# Altium project APP_1_rene0901.PrjPcb (part 1 of 2)
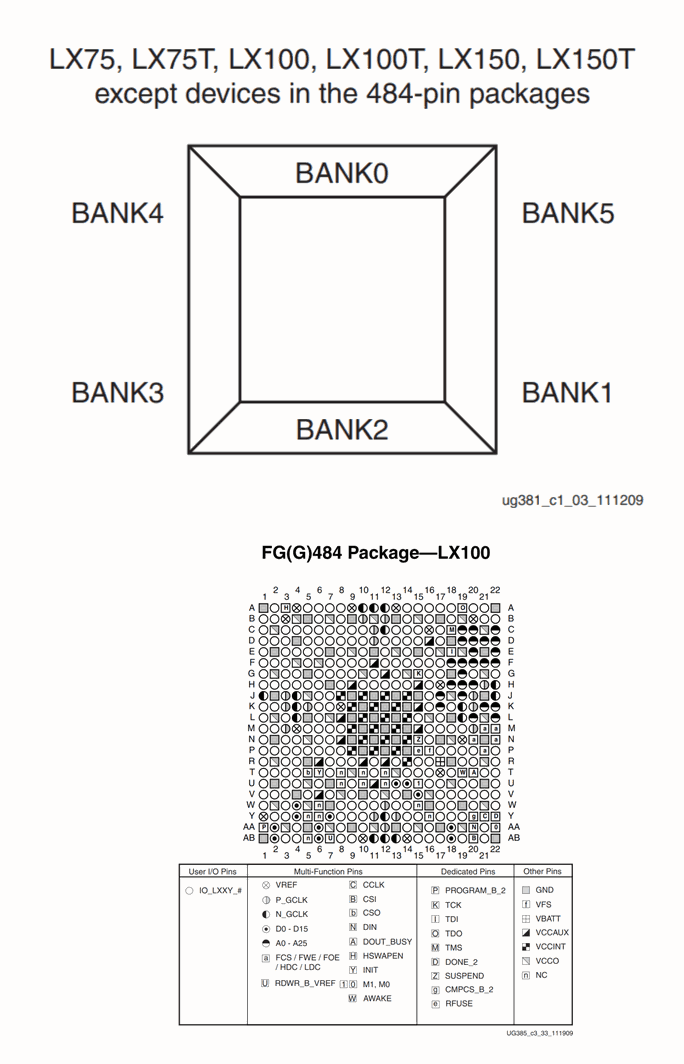
[diagram p0: APP_1_Overview.SchDoc]
Project_Date: 2024-01-12; Project_Designer1: Emile Renaud; Project_Designer2: Mathieu Huot; Project_Global: Conception PCB 1; Project_Group: N/A; Project_Name: APP_1_rene0901; Project_Revision: 1.00
13 sheets, 264 parts. Net scope: flat (ports and power ports of the same name join across sheets).
Sheets:
  APP_1_Title.SchDoc
  APP_1_Overview.SchDoc
  APP_1_Connectors_e.SchDoc
  APP_1_FPGA_e.SchDoc
  APP_1_DDR3_e.SchDoc
  APP_1_Prog.SchDoc
  APP_1_Stepper.SchDoc
  APP_1_DAC.SchDoc
  APP_1_ADC.SchDoc
  APP_1_Ethernet.SchDoc
  APP_1_Power.SchDoc
  APP_1_FlashSPI.SchDoc
  APP_1_PLL.SchDoc

## Sheet APP_1_Title.SchDoc
size Tabloid; DocumentNumber: 1; SheetNumber: 1; SheetTotal: 5; Sheet_Name: Insert name in Document Parameters; Size: 11x17

### Notes on the sheet
- Revision history
- Package size conversion
- Metric
- 1005
- 1608
- Imperial
- 0402
- 0603
- Revision
- 2012
- 3216
- 0805
- 1206
- 3225
- 6432
- 1210
- 2512
- Date :
- Project Title
- Global Project
- Size
- Date
- Group
- Sheet
- of
- Filename
- Designers

## Sheet APP_1_Overview.SchDoc: Overview
size Tabloid; DocumentNumber: 2; SheetNumber: 2; SheetTotal: 5; Sheet_Name: Overview; Size: 11x17

### Notes on the sheet
- Sheet Name
- Project Title
- Global Project
- Size
- Group
- Revision
- Date
- Sheet
- of
- Filename
- Designers

## Sheet APP_1_Connectors_e.SchDoc
size Tabloid; DocumentNumber: 3; SheetNumber: 3; SheetTotal: 12; Sheet_Name: Connectors; Size: 11x17
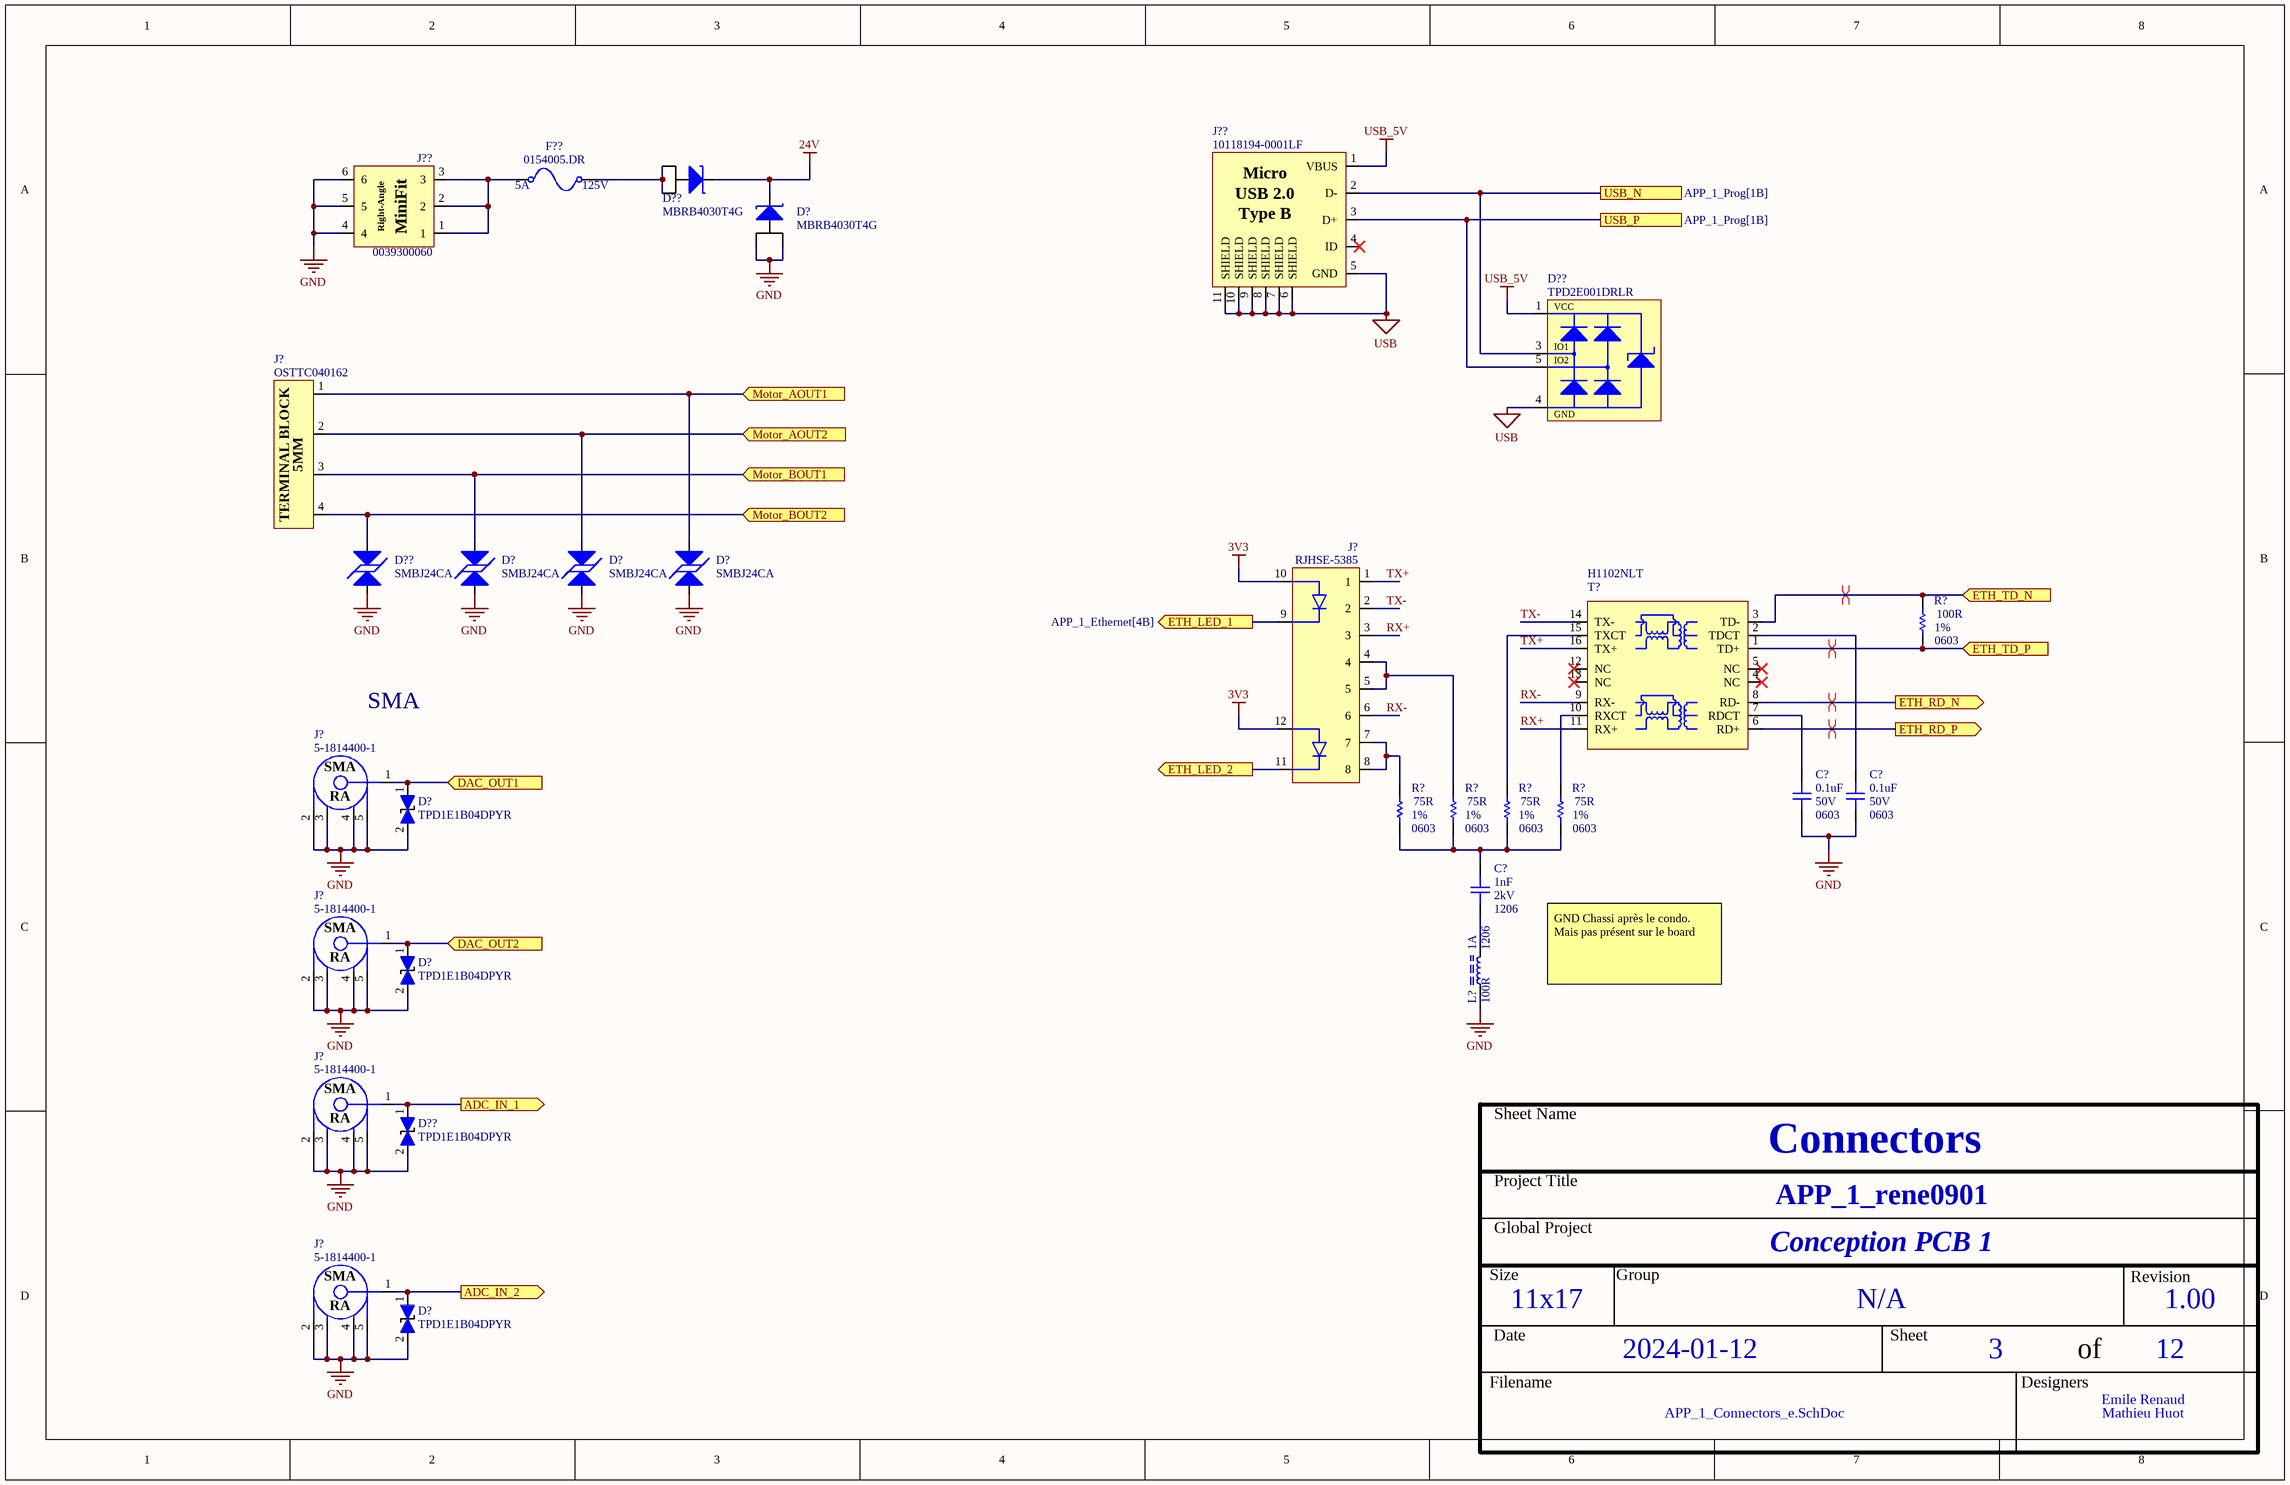
[diagram p1: APP_1_Connectors_e.SchDoc]

### Parts
(Parts that share a designator on the sheet are numbered #1, #2 ... from top to bottom, then left to right.)
C?#1  value 0.1uF  Voltage: 50V  Package: 0603  [CAP_0603]  (hidden comment: CAP - 0603)
C?#2  value 0.1uF  Voltage: 50V  Package: 0603  [CAP_0603]  (hidden comment: CAP - 0603)
C?#3  value 1nF  Voltage: 2kV  Package: 1206  [CAP_1206]  (hidden comment: CAP - 1206)
D?#1  MBRB4030T4G  [DIO_SCHOTTKY_MBRB4030T4G]
D?#2  SMBJ24CA  [TVS_PWR_SMBJ36CA]
D?#3  SMBJ24CA  [TVS_PWR_SMBJ36CA]
D?#4  SMBJ24CA  [TVS_PWR_SMBJ36CA]
D?#5  TPD1E1B04DPYR  [TVS_DATA_TPD1E1B04DPYR]
D?#6  TPD1E1B04DPYR  [TVS_DATA_TPD1E1B04DPYR]
D?#7  TPD1E1B04DPYR  [TVS_DATA_TPD1E1B04DPYR]
D??#1  MBRB4030T4G  [DIO_SCHOTTKY_MBRB4030T4G]
D??#2  TPD2E001DRLR  [TVS_USB_TPD2E001DRLR]
D??#3  SMBJ24CA  [TVS_PWR_SMBJ36CA]
D??#4  TPD1E1B04DPYR  [TVS_DATA_TPD1E1B04DPYR]
F??  0154005.DR  Voltage Rating: 125V  Current Rating: 5A  [FUS_0154XXX.DR]
J?#1  OSTTC040162  [CONN_TERMINAL_OSTTA040161]
J?#2  RJHSE-5385  [CONN_ETHERNET_RJHSE-5385]
J?#3  5-1814400-1  [CONN_SMA_5-1814400-1]
J?#4  5-1814400-1  [CONN_SMA_5-1814400-1]
J?#5  5-1814400-1  [CONN_SMA_5-1814400-1]
J?#6  5-1814400-1  [CONN_SMA_5-1814400-1]
J??#1  10118194-0001LF  [CON_USB_10118194-0001LF]
J??#2  0039300060  [CON_MINIFIT_0039300060]
L?#1  value 100R  Current: 1A  Package: 1206  [FER_1206]  (hidden comment: FER - 1206)
R?#1  value 100R  Package: 0603  Precision: 1%  [RES_0603]  (hidden comment: RES - 0603)
R?#2  value 75R  Package: 0603  Precision: 1%  [RES_0603]  (hidden comment: RES - 0603)
R?#3  value 75R  Package: 0603  Precision: 1%  [RES_0603]  (hidden comment: RES - 0603)
R?#4  value 75R  Package: 0603  Precision: 1%  [RES_0603]  (hidden comment: RES - 0603)
R?#5  value 75R  Package: 0603  Precision: 1%  [RES_0603]  (hidden comment: RES - 0603)
T?  H1102NLT  [TRANSFO_H1102NLT]

### Ports
ADC_IN_1 (out, see APP_1_ADC[1A]), ADC_IN_2 (out, see APP_1_ADC[1B]), DAC_OUT1 (in, see APP_1_DAC[5A]), DAC_OUT2 (in, see APP_1_DAC[5B]), ETH_LED_1 (out, see APP_1_Ethernet[4B]), ETH_LED_2 (out), ETH_RD_N (out, see APP_1_Ethernet[4B]), ETH_RD_P (out, see APP_1_Ethernet[4A]), ETH_TD_N (in, see APP_1_Ethernet[4A]), ETH_TD_P (in, see APP_1_Ethernet[4A]), Motor_AOUT1 (in, see APP_1_Stepper[5A]), Motor_AOUT2 (in, see APP_1_Stepper[5B]), Motor_BOUT1 (in, see APP_1_Stepper[5B]), Motor_BOUT2 (in, see APP_1_Stepper[5B]), USB_N (see APP_1_Prog[1B]), USB_P (see APP_1_Prog[1B])

### Nets
3V3: J?#2.10(LED1_A) J?#2.12(LED2_A)
24V: D?#1.4 D??#1.4
GND: C?#1.1 C?#2.1 D?#1.1(A) D?#1.3 D?#2.2 D?#3.2 D?#4.2 D?#5.2(i/o) D?#6.2(i/o) D?#7.2(i/o) D??#3.2 D??#4.2(i/o) J?#3.2 J?#3.3 J?#3.4 J?#3.5 J?#4.2 J?#4.3 J?#4.4 J?#4.5 J?#5.2 J?#5.3 J?#5.4 J?#5.5 J?#6.2 J?#6.3 J?#6.4 J?#6.5 J??#2.4 J??#2.5 J??#2.6 L?#1.2
USB: D??#2.4(GND) J??#1.5(GND) J??#1.6(SHIELD) J??#1.7(SHIELD) J??#1.8(SHIELD) J??#1.9(SHIELD) J??#1.10(SHIELD) J??#1.11(SHIELD)
USB_5V: D??#2.1(VCC) J??#1.1(VBUS)
ADC_IN_1: D??#4.1(i/o) J?#5.1 ; port ADC_IN_1
ADC_IN_2: D?#7.1(i/o) J?#6.1 ; port ADC_IN_2
DAC_OUT1: D?#5.1(i/o) J?#3.1 ; port DAC_OUT1
DAC_OUT2: D?#6.1(i/o) J?#4.1 ; port DAC_OUT2
ETH_LED_1: J?#2.9(LED1_K) ; port ETH_LED_1
ETH_LED_2: J?#2.11(LED2_K) ; port ETH_LED_2
ETH_RD_N: T?.8(RD-) ; port ETH_RD_N
ETH_RD_P: T?.6(RD+) ; port ETH_RD_P
ETH_TD_N: R?#1.2 T?.3(TD-) ; port ETH_TD_N
ETH_TD_P: R?#1.1 T?.1(TD+) ; port ETH_TD_P
Motor_AOUT1: D?#4.1 J?#1.1 ; port Motor_AOUT1
Motor_AOUT2: D?#3.1 J?#1.2 ; port Motor_AOUT2
Motor_BOUT1: D?#2.1 J?#1.3 ; port Motor_BOUT1
Motor_BOUT2: D??#3.1 J?#1.4 ; port Motor_BOUT2
RX+: J?#2.3 T?.11(RX+)
RX-: J?#2.6 T?.9(RX-)
TX+: J?#2.1 T?.16(TX+)
TX-: J?#2.2 T?.14(TX-)
USB_N: D??#2.3(IO1) J??#1.2(D-) ; port USB_N
USB_P: D??#2.5(IO2) J??#1.3(D+) ; port USB_P
NetC?#1_2: C?#1.2 T?.7(RDCT)
NetC?#2_2: C?#2.2 T?.2(TDCT)
NetC?#3_1: C?#3.1 L?#1.1
NetC?#3_2: C?#3.2 R?#2.1 R?#3.1 R?#4.1 R?#5.1
NetD??#1_1: D??#1.1(A) D??#1.3 F??.2
NetF??_1: F??.1 J??#2.1 J??#2.2 J??#2.3
NetJ?#2_4: J?#2.4 J?#2.5 R?#3.2
NetJ?#2_7: J?#2.7 J?#2.8 R?#2.2
NetR?#4_2: R?#4.2 T?.15(TXCT)
NetR?#5_2: R?#5.2 T?.10(RXCT)

Not connected (* = marked no-connect by the designer): D??#2 2(NC); J??#1 4(ID)*; T? 4(NC)* 5(NC)* 12(NC)* 13(NC)*

### Layout directives
differential pair: ETH_RD_N, ETH_RD_P, ETH_TD_N, ETH_TD_P

### Notes on the sheet
- SMA
- GND Chassi après le condo. Mais pas présent sur le board
- Sheet Name
- Project Title
- Global Project
- Size
- Group
- Revision
- Date
- Sheet
- of
- Filename
- Designers
- (in symbol CON_MINIFIT_0039300060) Right-Angle; MiniFit
- (in symbol CON_USB_10118194-0001LF) Micro; USB 2.0; Type B
- (in symbol CONN_SMA_5-1814400-1) SMA; RA
- (in symbol CONN_TERMINAL_OSTTC040162) TERMINAL BLOCK; 5MM

### Library data of the parts
C?#1 C?#2 = CAP - 0603: Precision: 10%; Current: *; CreatedBy: Jonathan Bouchard; Power: *
C?#3 = CAP - 1206: Precision: 10%; Current: *; CreatedBy: Jonathan Bouchard; Power: *
D?#1 D??#1 = DIO_SCHOTTKY_MBRB4030T4G: DIO - 30V MAX 40 A - TO-263-3; Manufacturer #1: ON Semiconductor; Value: Vf = 550mV @ 40A; Current Rating: 40A; GRAMS Lib Spec: 2.8; Magnetic Material: NO; Polarized: Yes; Cryo: UNKNOWN; Tolerance: *; Voltage Rating: 30V; Power Max: *; HelpURL: http://www.onsemi.com/pub/Collateral/MBRB4030-D.PDF; CreatedBy/Date: Arnaud Samson - 06/07/18; VerifiedBy: Jonathan Bouchard 2018-07-12; Temperature: -65°C ~ 175°C; Package: D2PAK; Manufacturer #2: *; Note: *; Assembly Type: SMD; Part Number #2: *; Part Number #1: MBRB4030T4G; Supplier 1: Digi-Key; Supplier Part Number 1: MBRB4030T4GOSCT-ND
D?#2-D?#4 D??#3 = TVS_PWR_SMBJ24CA: TVS - 24V 26.7V 600W - DO214AA; Manufacturer #1: Littelfuse Inc.; Value: Vbr = 26.7V -  Clamp = 38.9V; Voltage Rating: 24V Standoff; Current Rating: 15.5A; GRAMS Lib Spec: 2.8; Magnetic Material: UNKNOWN; Polarized: NO; Tolerance: *; Power Max: 600W; HelpURL: http://www.littelfuse.com/~/media/electronics/datasheets/tvs_diodes/littelfuse_tvs_diode_smbj_datasheet.pdf.pdf; CreatedBy/Date: Arnaud Samson - 06/07/18; VerifiedBy: Jonathan Bouchard - 2018-07-13; Temperature: -65°C ~ 150°C (TJ); Package: DO214AA; Manufacturer #2: *; Note: *; Assembly Type: SMD; Part Number #2: *; Part Number #1: SMBJ24CA; Supplier 1: Digi-Key; Supplier Part Number 1: SMBJ24CALFCT-ND; Cryo: UNKNOWN
D?#5-D?#7 D??#4 = TVS_DATA_TPD1E1B04DPYR: TVS - TVS DIODE 3.6V 8.5V - 0402; Manufacturer #1: Texas Instruments; Current Rating: 6.3Apeak; Power Max: 50Wpeak; GRAMS Lib Spec: 2.8; Magnetic Material: Unknown; Polarized: No; Value: *; Tolerance: *; Voltage Rating: 3.6V; HelpURL: http://www.ti.com/lit/ds/symlink/tpd1e1b04.pdf; CreatedBy/Date: Keven Deslandes - 2018/10/19; VerifiedBy: Caroline Paulin - 28 janv 2019; Temperature: -40°C ~ 125°C (TA); Package: 0402; Manufacturer #2: *; Note: *; Assembly Type: SMD; Part Number #2: *; Part Number #1: TPD1E1B04DPYR; Supplier 1: Digi-Key; Supplier Part Number 1: 296-47364-1-ND; Cryo: UNKNOWN
D??#2 = TVS_USB_TPD2E001DRLR: TVS - USB TVS DIODE 5.5V - SOT-553; Manufacturer #1: Texas Instruments; Value: 11V Breakdown; Voltage Rating: 5.5V (Max); GRAMS Lib Spec: 2.8; Magnetic Material: YES; Cryo: UNKNOWN; Tolerance: *; Current Rating: *; Power Max: *; HelpURL: http://www.ti.com/lit/ds/symlink/tpd2e001.pdf; CreatedBy/Date: Jonathan Bouchard 2018-07-10; VerifiedBy: Arnaud Samson 16-07-18; Temperature: -40°C ~ 85°C (TA); Package: SOT-553; Manufacturer #2: *; Note: *; Assembly Type: SMD; Part Number #2: *; Part Number #1: TPD2E001DRLR; Polarized: YES; Supplier 1: Digi-Key; Supplier Part Number 1: 296-21883-1-ND
F?? = FUS_0154005.DR: FUS - 5 A 125 VAC/VDC - 2-SMD; Manufacturer #1: Littelfuse Inc.; Value: 5A 125V AC/DC FAST; GRAMS Lib Spec: 2.8; Magnetic Material: UNKNOWN; Polarized: NO; Tolerance: *; Power Max: *; HelpURL: http://www.littelfuse.com/~/media/electronics/datasheets/fuses/littelfuse_fuse_154_154t_154l_154tl_datasheet.pdf.pdf; CreatedBy/Date: Arnaud Samson - 06/07/18; VerifiedBy: Jonathan Bouchard 2018-07-16; Temperature: -55°C ~ 125°C; Package: 2-SMD; Manufacturer #2: *; Note: *; Assembly Type: SMD; Part Number #2: *; Part Number #1: 0154005.DR; Supplier 1: Digi-Key; Supplier Part Number 1: F1228CT-ND; Cryo: UNKNOWN
J?#1 = CONN_TERMINAL_OSTTC040162: CONN -  TERMINAL BLOCK 4POS 5MM - TH; Mfg: On Shore Technology Inc.; Voltage: *; Current: *; Power: *; Mfg Part Number: OSTTC040162; HelpURL: http://www.on-shore.com/wp-content/uploads/2015/09/osttcxx0162.pdf; CreatedBy: Jonathan Bouchard; Temperature: -30°C ~ 105°C; Value: *; Precision: *; Package: TH-4; Supplier 1: Digikey; Supplier Part Number 1: ED2602-ND
J?#2 = CONN_ETHERNET_RJHSE-5385: CONN - MOD JACK RJ45 R/A ETHERNET - TH; Mfg: Amphenol; Voltage: *; Current: *; Power: *; Mfg Part Number: RJHSE-5385; HelpURL: https://www.amphenolcanada.com/ProductSearch/drawings/AC/RJHSE538X.pdf; CreatedBy: Jonathan Bouchard; Temperature: -55°C ~ 85°C; Value: *; Precision: *; Package: TH-12; Supplier 1: Digikey; Supplier Part Number 1: RJHSE-5385-ND
J?#3-J?#6 = CONN_SMA_5-1814400-1: CONN -  SMA JACK R/A 50 OHM - TH; Mfg: TE Connectivity AMP Connectors; Voltage: *; Current: *; Power: *; Mfg Part Number: 5-1814400-1; HelpURL: http://www.te.com/commerce/DocumentDelivery/DDEController?Action=srchrtrv&DocNm=1814400&DocType=Customer+Drawing&DocLang=English; CreatedBy: Jonathan Bouchard; Temperature: -55°C ~ 85°C; Value: *; Precision: *; Package: TH-5; Supplier 1: Digikey; Supplier Part Number 1: A97593-ND
J??#1 = CON_USB_10118194-0001LF: CON - USB MICRO B RECPT SMT R/A - 4PIN; Manufacturer #1: Amphenol FCI; Value: USB - Micro B; Voltage Rating: 100VAC; Current Rating: 1.8A; GRAMS Lib Spec: 2.8; Magnetic Material: YES; Cryo: UNKNOWN; Tolerance: *; Power Max: *; HelpURL: https://cdn.amphenol-icc.com/media/wysiwyg/files/drawing/10118194.pdf; CreatedBy/Date: Arnaud Samson - 09/07/18; VerifiedBy: Jonathan Bouchard 2018-07-12; Temperature: -30°C ~ 80°C; Package: 5-SMD; Manufacturer #2: *; Note: *; Assembly Type: SMD; Part Number #2: *; Part Number #1: 10118194-0001LF; Polarized: YES; Supplier 1: Digi-Key; Supplier Part Number 1: 609-4618-1-ND
J??#2 = CON_MINIFIT_0039300060: CON - Mini-Fit Through Hole, Right Angle 6 position; Manufacturer #1: Molex; Current Rating: 8A; GRAMS Lib Spec: 2.8; Magnetic Material: Unknown; Polarized: Yes; Voltage Rating: 600V; Assembly Type: TH; CreatedBy/Date: Joel Lemay 2018-06-21; HelpURL: https://www.molex.com/pdm_docs/sd/039300060_sd.pdf; Manufacturer #2: *; Package: TH; Part Number #1: 0039300060; Part Number #2: *; Power Max: *; Supplier 1: Digi-Key; Supplier Part Number 1: WM21353-ND; Temperature: - 40°C to + 80°C; Tolerance: *; Value: *; VerifiedBy: Caroline Paulin - 10 sept 2018; Cryo: UNKNOWN
T? = TRANSFO_H1102NLT: TRANSFO - ETHERNET 10/100B-TX - SMD-16; Mfg: Pulse Eng.; Value: 1:1 (350uH); Voltage: *; Current: *; Power: *; Mfg Part Number: H1102NLT; HelpURL: http://media.digikey.com/pdf/Data%20Sheets/Pulse%20PDFs/10_100BASE-T%20Single%20Port%20SMD%20Magnetics_Rev2008.pdf; CreatedBy: Jonathan Bouchard; Temperature: -40°C to 85°C; Precision: *; Package: SMD-16; Supplier 1: Digikey; Supplier Part Number 1: 553-1532-1-ND
L?#1 = FER - 1206: Voltage: *; CreatedBy: Jonathan Bouchard; Power: *; Precision: *
R?#1-R?#5 = RES - 0603: Current: *; CreatedBy: Jonathan Bouchard

## Sheet APP_1_FPGA_e.SchDoc
size Tabloid; DocumentNumber: 4; SheetNumber: 4; SheetTotal: 13; Sheet_Name: FPGA; Size: 11x17
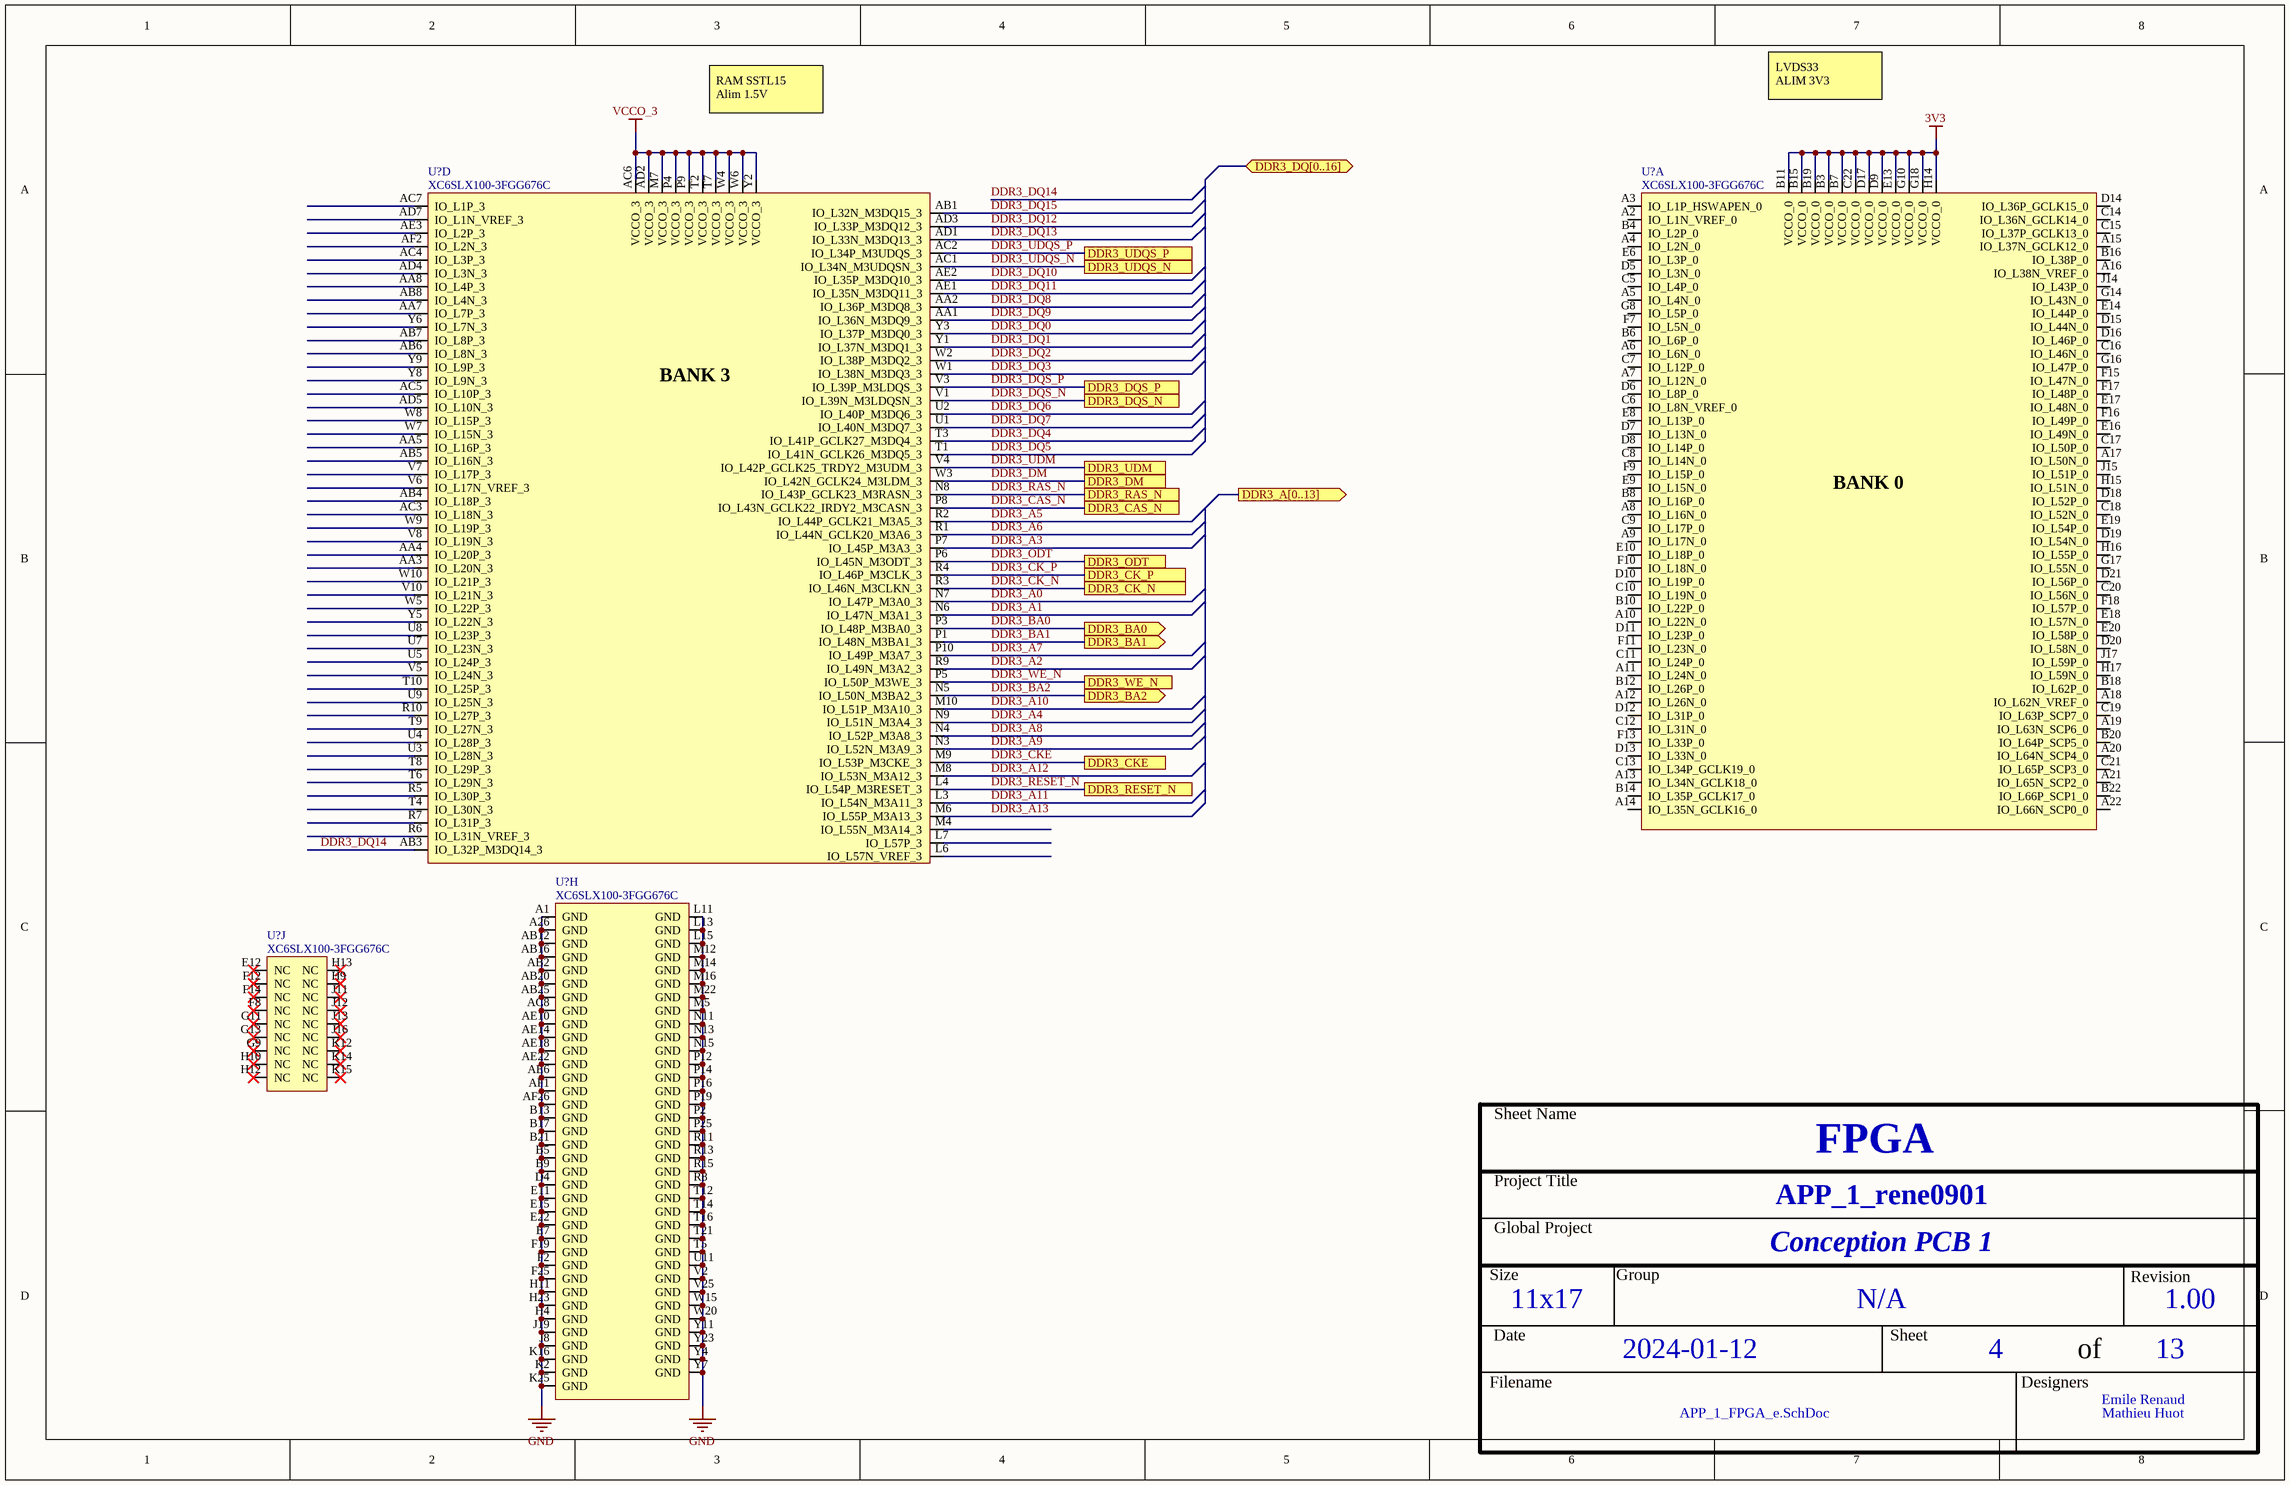
[diagram p2: APP_1_FPGA_e.SchDoc]

### Parts
(Parts that share a designator on the sheet are numbered #1, #2 ... from top to bottom, then left to right.)
U?#1  XC6SLX100-3FGG676C  [FPGA_XILINX_FGG676]  (part D of 10)
U?#2  XC6SLX100-3FGG676C  [FPGA_XILINX_FGG676]  (part A of 10)
U?#3  XC6SLX100-3FGG676C  [FPGA_XILINX_FGG676]  (part H of 10)
U?#4  XC6SLX100-3FGG676C  [FPGA_XILINX_FGG676]  (part J of 10)

### Ports
DDR3_A[0..13] (out, see APP_1_DDR3_e[1B]), DDR3_BA0 (out, see APP_1_DDR3_e[2C]), DDR3_BA1 (out, see APP_1_DDR3_e[2C]), DDR3_BA2 (out, see APP_1_DDR3_e[2C]), DDR3_CAS_N (see APP_1_DDR3_e[2D]), DDR3_CK_N (see APP_1_DDR3_e[1C]), DDR3_CK_P (see APP_1_DDR3_e[1C]), DDR3_CKE, DDR3_DM, DDR3_DQ[0..16] (bidir, see APP_1_DDR3_e[4B]), DDR3_DQS_N, DDR3_DQS_P, DDR3_ODT (see APP_1_DDR3_e[2D]), DDR3_RAS_N (see APP_1_DDR3_e[2C]), DDR3_RESET_N, DDR3_UDM (see APP_1_DDR3_e[4C]), DDR3_UDQS_N (see APP_1_DDR3_e[4C]), DDR3_UDQS_P (see APP_1_DDR3_e[4C]), DDR3_WE_N (see APP_1_DDR3_e[2D])

### Nets
3V3: U?#2.B3(VCCO_0) U?#2.B7(VCCO_0) U?#2.B11(VCCO_0) U?#2.B15(VCCO_0) U?#2.B19(VCCO_0) U?#2.C22(VCCO_0) U?#2.D9(VCCO_0) U?#2.D17(VCCO_0) U?#2.E13(VCCO_0) U?#2.G10(VCCO_0) U?#2.G18(VCCO_0) U?#2.H14(VCCO_0)
GND: U?#3.A1(GND) U?#3.A26(GND) U?#3.AB2(GND) U?#3.AB12(GND) U?#3.AB16(GND) U?#3.AB20(GND) U?#3.AB25(GND) U?#3.AC8(GND) U?#3.AE6(GND) U?#3.AE10(GND) U?#3.AE14(GND) U?#3.AE18(GND) U?#3.AE22(GND) U?#3.AF1(GND) U?#3.AF26(GND) U?#3.B5(GND) U?#3.B9(GND) U?#3.B13(GND) U?#3.B17(GND) U?#3.B21(GND) U?#3.D4(GND) U?#3.E7(GND) U?#3.E11(GND) U?#3.E15(GND) U?#3.E22(GND) U?#3.F2(GND) U?#3.F19(GND) U?#3.F25(GND) U?#3.H4(GND) U?#3.H11(GND) U?#3.H23(GND) U?#3.J8(GND) U?#3.J19(GND) U?#3.K2(GND) U?#3.K16(GND) U?#3.K25(GND) U?#3.L11(GND) U?#3.L13(GND) U?#3.L15(GND) U?#3.M5(GND) U?#3.M12(GND) U?#3.M14(GND) U?#3.M16(GND) U?#3.M22(GND) U?#3.N11(GND) U?#3.N13(GND) U?#3.N15(GND) U?#3.P2(GND) U?#3.P12(GND) U?#3.P14(GND) U?#3.P16(GND) U?#3.P19(GND) U?#3.P25(GND) U?#3.R8(GND) U?#3.R11(GND) U?#3.R13(GND) U?#3.R15(GND) U?#3.T5(GND) U?#3.T12(GND) U?#3.T14(GND) U?#3.T16(GND) U?#3.T21(GND) U?#3.U11(GND) U?#3.V2(GND) U?#3.V25(GND) U?#3.W15(GND) U?#3.W20(GND) U?#3.Y4(GND) U?#3.Y7(GND) U?#3.Y11(GND) U?#3.Y23(GND)
VCCO_3: U?#1.AC6(VCCO_3) U?#1.AD2(VCCO_3) U?#1.M7(VCCO_3) U?#1.P4(VCCO_3) U?#1.P9(VCCO_3) U?#1.T2(VCCO_3) U?#1.T7(VCCO_3) U?#1.W4(VCCO_3) U?#1.W6(VCCO_3) U?#1.Y2(VCCO_3)
DDR3_A0: U?#1.N7(IO_L47P_M3A0_3)
DDR3_A1: U?#1.N6(IO_L47N_M3A1_3)
DDR3_A2: U?#1.R9(IO_L49N_M3A2_3)
DDR3_A3: U?#1.P7(IO_L45P_M3A3_3)
DDR3_A4: U?#1.N9(IO_L51N_M3A4_3)
DDR3_A5: U?#1.R2(IO_L44P_GCLK21_M3A5_3)
DDR3_A6: U?#1.R1(IO_L44N_GCLK20_M3A6_3)
DDR3_A7: U?#1.P10(IO_L49P_M3A7_3)
DDR3_A8: U?#1.N4(IO_L52P_M3A8_3)
DDR3_A9: U?#1.N3(IO_L52N_M3A9_3)
DDR3_A10: U?#1.M10(IO_L51P_M3A10_3)
DDR3_A11: U?#1.L3(IO_L54N_M3A11_3)
DDR3_A12: U?#1.M8(IO_L53N_M3A12_3)
DDR3_A13: U?#1.M6(IO_L55P_M3A13_3)
DDR3_BA0: U?#1.P3(IO_L48P_M3BA0_3) ; port DDR3_BA0
DDR3_BA1: U?#1.P1(IO_L48N_M3BA1_3) ; port DDR3_BA1
DDR3_BA2: U?#1.N5(IO_L50N_M3BA2_3) ; port DDR3_BA2
DDR3_CAS_N: U?#1.P8(IO_L43N_GCLK22_IRDY2_M3CASN_3) ; port DDR3_CAS_N
DDR3_CK_N: U?#1.R3(IO_L46N_M3CLKN_3) ; port DDR3_CK_N
DDR3_CK_P: U?#1.R4(IO_L46P_M3CLK_3) ; port DDR3_CK_P
DDR3_CKE: U?#1.M9(IO_L53P_M3CKE_3) ; port DDR3_CKE
DDR3_DM: U?#1.W3(IO_L42N_GCLK24_M3LDM_3) ; port DDR3_DM
DDR3_DQ0: U?#1.Y3(IO_L37P_M3DQ0_3)
DDR3_DQ1: U?#1.Y1(IO_L37N_M3DQ1_3)
DDR3_DQ2: U?#1.W2(IO_L38P_M3DQ2_3)
DDR3_DQ3: U?#1.W1(IO_L38N_M3DQ3_3)
DDR3_DQ4: U?#1.T3(IO_L41P_GCLK27_M3DQ4_3)
DDR3_DQ5: U?#1.T1(IO_L41N_GCLK26_M3DQ5_3)
DDR3_DQ6: U?#1.U2(IO_L40P_M3DQ6_3)
DDR3_DQ7: U?#1.U1(IO_L40N_M3DQ7_3)
DDR3_DQ8: U?#1.AA2(IO_L36P_M3DQ8_3)
DDR3_DQ9: U?#1.AA1(IO_L36N_M3DQ9_3)
DDR3_DQ10: U?#1.AE2(IO_L35P_M3DQ10_3)
DDR3_DQ11: U?#1.AE1(IO_L35N_M3DQ11_3)
DDR3_DQ12: U?#1.AD3(IO_L33P_M3DQ12_3)
DDR3_DQ13: U?#1.AD1(IO_L33N_M3DQ13_3)
DDR3_DQ14: U?#1.AB3(IO_L32P_M3DQ14_3)
DDR3_DQ15: U?#1.AB1(IO_L32N_M3DQ15_3)
DDR3_DQS_N: U?#1.V1(IO_L39N_M3LDQSN_3) ; port DDR3_DQS_N
DDR3_DQS_P: U?#1.V3(IO_L39P_M3LDQS_3) ; port DDR3_DQS_P
DDR3_ODT: U?#1.P6(IO_L45N_M3ODT_3) ; port DDR3_ODT
DDR3_RAS_N: U?#1.N8(IO_L43P_GCLK23_M3RASN_3) ; port DDR3_RAS_N
DDR3_RESET_N: U?#1.L4(IO_L54P_M3RESET_3) ; port DDR3_RESET_N
DDR3_UDM: U?#1.V4(IO_L42P_GCLK25_TRDY2_M3UDM_3) ; port DDR3_UDM
DDR3_UDQS_N: U?#1.AC1(IO_L34N_M3UDQSN_3) ; port DDR3_UDQS_N
DDR3_UDQS_P: U?#1.AC2(IO_L34P_M3UDQS_3) ; port DDR3_UDQS_P
DDR3_WE_N: U?#1.P5(IO_L50P_M3WE_3) ; port DDR3_WE_N

Not connected (* = marked no-connect by the designer): U?#1 AA3(IO_L20N_3) AA4(IO_L20P_3) AA5(IO_L16P_3) AA7(IO_L7P_3) AA8(IO_L4P_3) AB4(IO_L18P_3) AB5(IO_L16N_3) AB6(IO_L8N_3) AB7(IO_L8P_3) AB8(IO_L4N_3) AC3(IO_L18N_3) AC4(IO_L3P_3) AC5(IO_L10P_3) AC7(IO_L1P_3) AD4(IO_L3N_3) AD5(IO_L10N_3) AD7(IO_L1N_VREF_3) AE3(IO_L2P_3) AF2(IO_L2N_3) L6(IO_L57N_VREF_3) L7(IO_L57P_3) M4(IO_L55N_M3A14_3) R5(IO_L30P_3) R6(IO_L31N_VREF_3) R7(IO_L31P_3) R10(IO_L27P_3) T4(IO_L30N_3) T6(IO_L29N_3) T8(IO_L29P_3) T9(IO_L27N_3) T10(IO_L25P_3) U3(IO_L28N_3) U4(IO_L28P_3) U5(IO_L24P_3) U7(IO_L23N_3) U8(IO_L23P_3) U9(IO_L25N_3) V5(IO_L24N_3) V6(IO_L17N_VREF_3) V7(IO_L17P_3) V8(IO_L19N_3) V10(IO_L21N_3) W5(IO_L22P_3) W7(IO_L15N_3) W8(IO_L15P_3) W9(IO_L19P_3) W10(IO_L21P_3) Y5(IO_L22N_3) Y6(IO_L7N_3) Y8(IO_L9N_3) Y9(IO_L9P_3); U?#2 A2(IO_L1N_VREF_0) A3(IO_L1P_HSWAPEN_0) A4(IO_L2N_0) A5(IO_L4N_0) A6(IO_L6N_0) A7(IO_L12N_0) A8(IO_L16N_0) A9(IO_L17N_0) A10(IO_L22N_0) A11(IO_L24N_0) A12(IO_L26N_0) A13(IO_L34N_GCLK18_0) A14(IO_L35N_GCLK16_0) A15(IO_L37N_GCLK12_0) A16(IO_L38N_VREF_0) A17(IO_L50N_0) A18(IO_L62N_VREF_0) A19(IO_L63N_SCP6_0) A20(IO_L64N_SCP4_0) A21(IO_L65N_SCP2_0) A22(IO_L66N_SCP0_0) B4(IO_L2P_0) B6(IO_L6P_0) B8(IO_L16P_0) B10(IO_L22P_0) B12(IO_L26P_0) B14(IO_L35P_GCLK17_0) B16(IO_L38P_0) B18(IO_L62P_0) B20(IO_L64P_SCP5_0) B22(IO_L66P_SCP1_0) C5(IO_L4P_0) C6(IO_L8N_VREF_0) C7(IO_L12P_0) C8(IO_L14N_0) C9(IO_L17P_0) C10(IO_L19N_0) C11(IO_L24P_0) C12(IO_L31N_0) C13(IO_L34P_GCLK19_0) C14(IO_L36N_GCLK14_0) C15(IO_L37P_GCLK13_0) C16(IO_L46N_0) C17(IO_L50P_0) C18(IO_L52N_0) C19(IO_L63P_SCP7_0) C20(IO_L56N_0) C21(IO_L65P_SCP3_0) D5(IO_L3N_0) D6(IO_L8P_0) D7(IO_L13N_0) D8(IO_L14P_0) D10(IO_L19P_0) D11(IO_L23P_0) D12(IO_L31P_0) D13(IO_L33N_0) D14(IO_L36P_GCLK15_0) D15(IO_L44N_0) D16(IO_L46P_0) D18(IO_L52P_0) D19(IO_L54N_0) D20(IO_L58N_0) D21(IO_L56P_0) E6(IO_L3P_0) E8(IO_L13P_0) E9(IO_L15N_0) E10(IO_L18P_0) E14(IO_L44P_0) E16(IO_L49N_0) E17(IO_L48N_0) E18(IO_L57N_0) E19(IO_L54P_0) E20(IO_L58P_0) F7(IO_L5N_0) F9(IO_L15P_0) F10(IO_L18N_0) F11(IO_L23N_0) F13(IO_L33P_0) F15(IO_L47N_0) F16(IO_L49P_0) F17(IO_L48P_0) F18(IO_L57P_0) G8(IO_L5P_0) G14(IO_L43N_0) G16(IO_L47P_0) G17(IO_L55N_0) H15(IO_L51N_0) H16(IO_L55P_0) H17(IO_L59N_0) J14(IO_L43P_0) J15(IO_L51P_0) J17(IO_L59P_0); U?#4 E12(NC)* F8(NC)* F12(NC)* F14(NC)* G9(NC)* G11(NC)* G13(NC)* H9(NC)* H10(NC)* H12(NC)* H13(NC)* J11(NC)* J12(NC)* J13(NC)* J16(NC)* K12(NC)* K14(NC)* K15(NC)*

### Notes on the sheet
- LVDS33
  ALIM 3V3
- RAM SSTL15
  Alim 1.5V
- Sheet Name
- Project Title
- Global Project
- Size
- Group
- Revision
- Date
- Sheet
- of
- Filename
- Designers
- (in symbol FPGA_XC6SLX100-3FGG676C, part A) BANK 0
- (in symbol FPGA_XC6SLX100-3FGG676C, part D) BANK 3

### Library data of the parts
U?#1-U?#4 = FPGA_XC6SLX100-3FGG676C: FPGA - XILINX SPARTAN 6 480 I/O - BGA-676; Voltage: 1.14 V ~ 1.26 V; Current: *; Power: *; Mfg: Xilinx; Mfg Part Number: XC6SLX100-3FGG676C; HelpURL: https://www.xilinx.com/support/documentation/data_sheets/ds162.pdf; CreatedBy: Jonathan Bouchard; Temperature: 0°C ~ 85°C (TJ); Value: *; Precision: *; Package: BGA-676; Supplier 1: Digikey; Supplier Part Number 1: 122-1760-ND

## Sheet APP_1_DDR3_e.SchDoc
size Tabloid; DocumentNumber: 5; SheetNumber: 5; SheetTotal: 13; Sheet_Name: DDR3; Size: 11x17
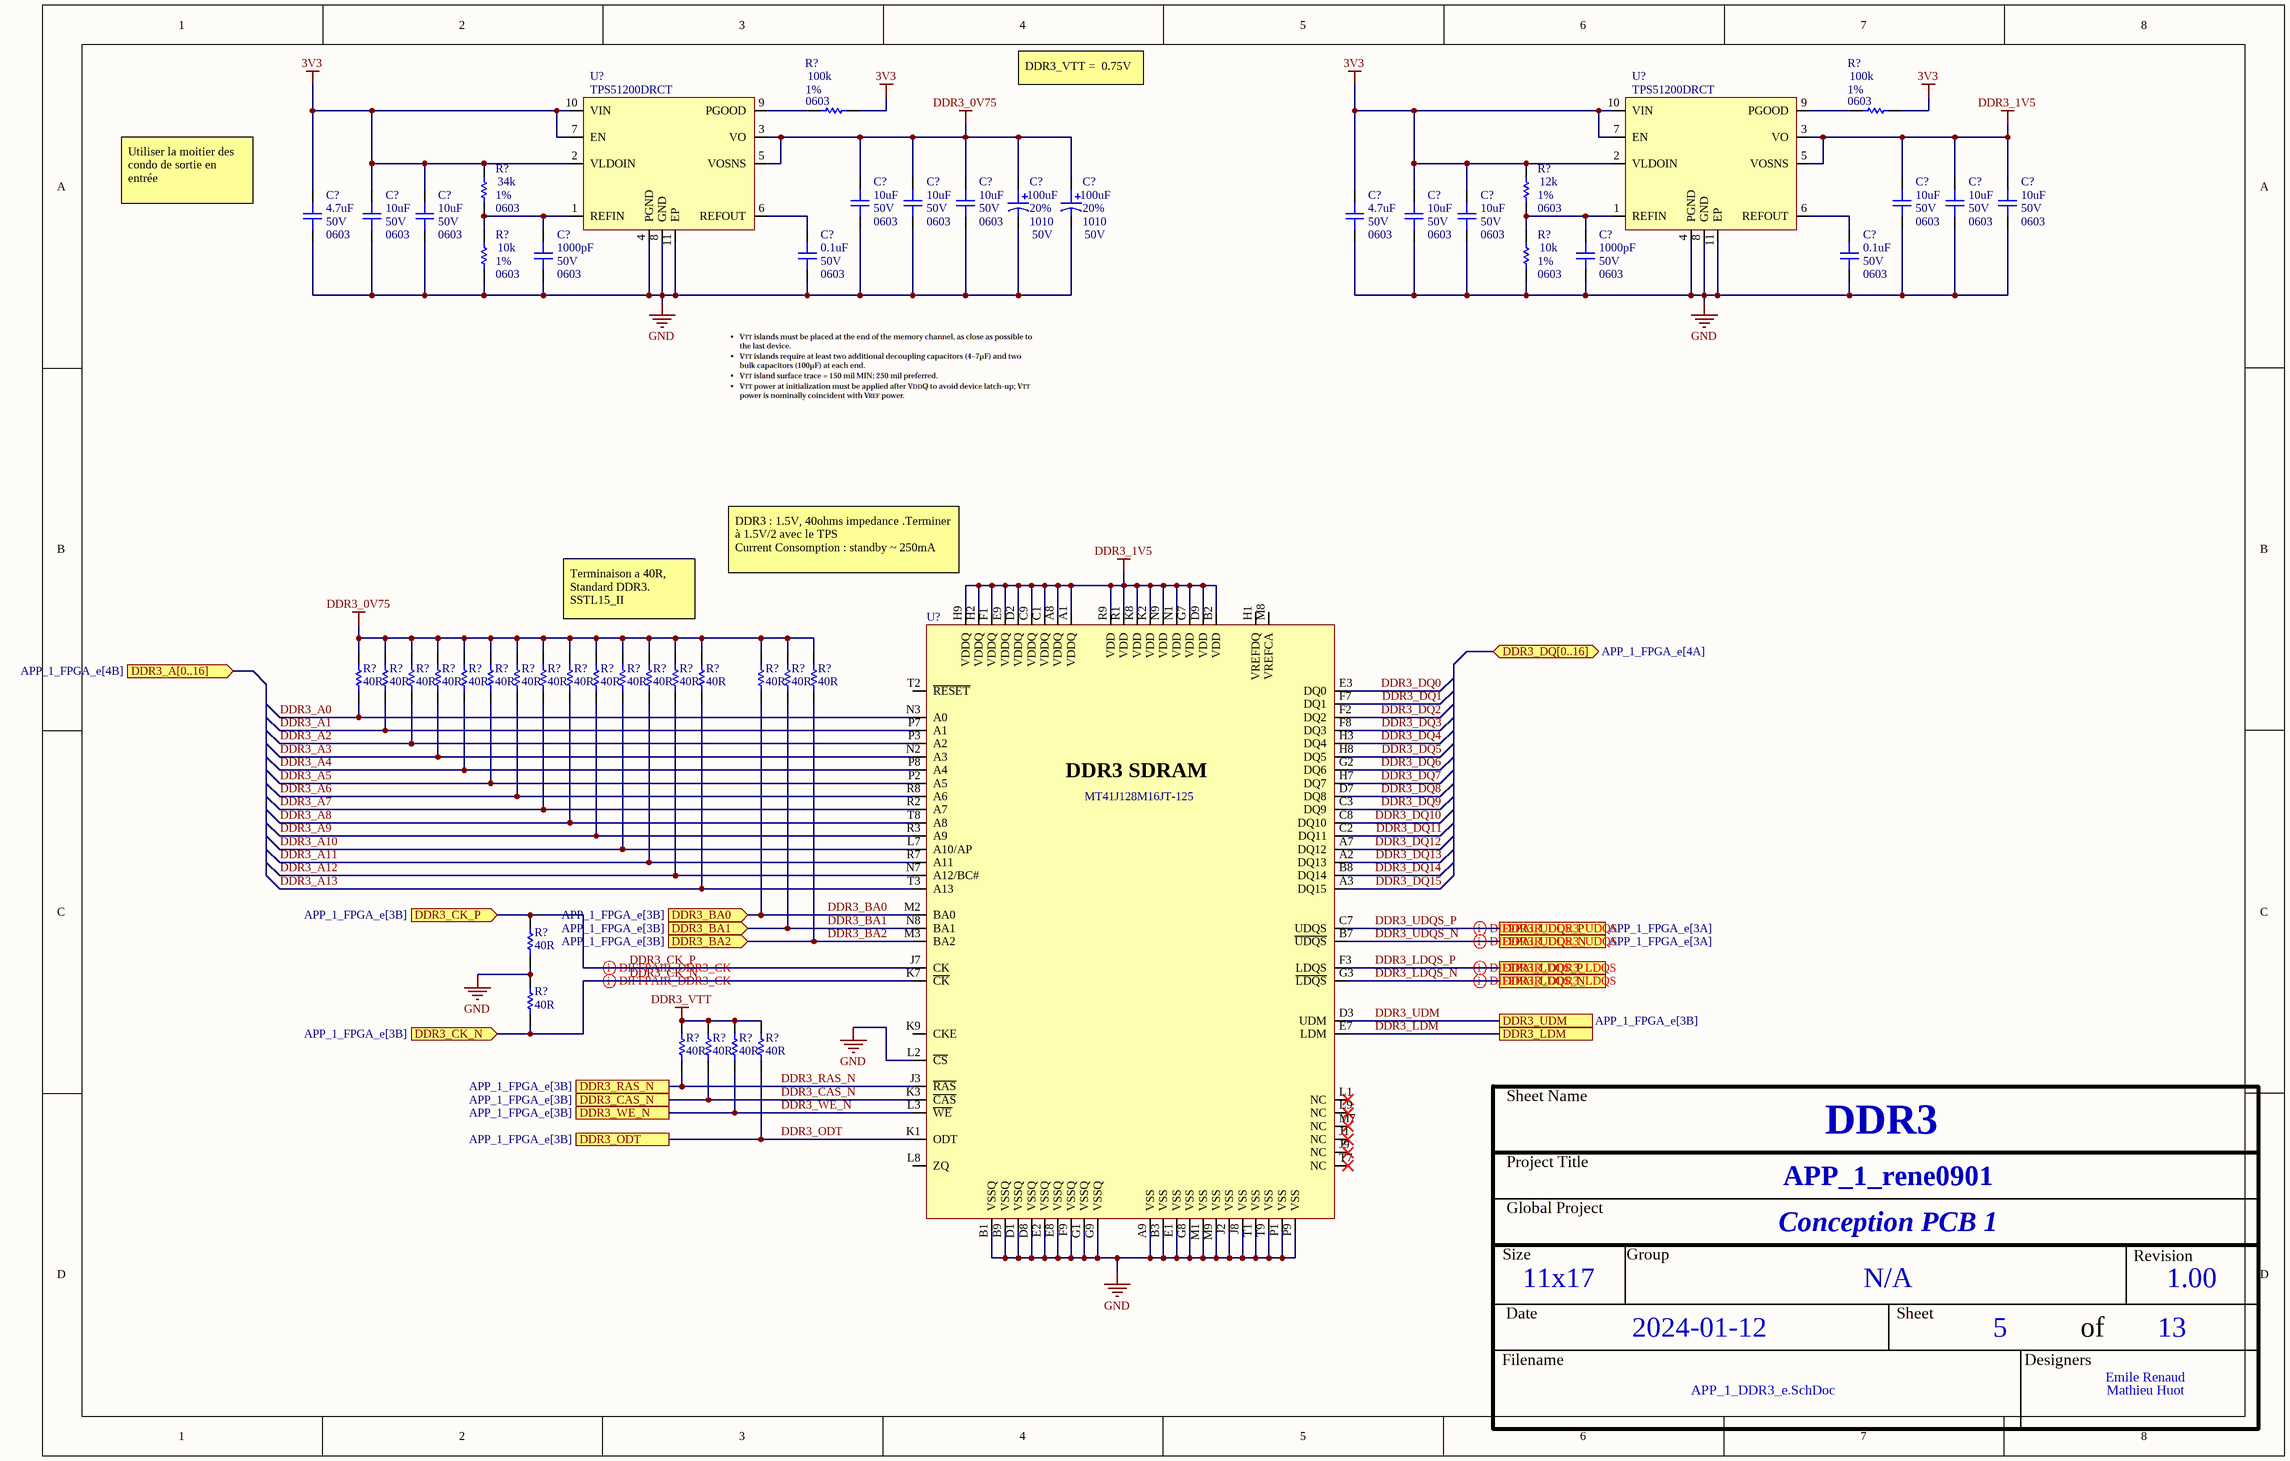
[diagram p3: APP_1_DDR3_e.SchDoc]

### Parts
(Parts that share a designator on the sheet are numbered #1, #2 ... from top to bottom, then left to right.)
C?#4  value 10uF  Voltage: 50V  Package: 0603  [CAP_0603]  (hidden comment: CAP - 0603)
C?#5  value 10uF  Voltage: 50V  Package: 0603  [CAP_0603]  (hidden comment: CAP - 0603)
C?#6  value 10uF  Voltage: 50V  Package: 0603  [CAP_0603]  (hidden comment: CAP - 0603)
C?#7  value 100uF  Voltage: 50V  Package: 1010  Precision: 20%  [CAP_ALU_1010_vishay]  (hidden comment: MAL215099101E3)
C?#8  value 100uF  Voltage: 50V  Package: 1010  Precision: 20%  [CAP_ALU_1010_vishay]  (hidden comment: MAL215099101E3)
C?#9  value 10uF  Voltage: 50V  Package: 0603  [CAP_0603]  (hidden comment: CAP - 0603)
C?#10  value 10uF  Voltage: 50V  Package: 0603  [CAP_0603]  (hidden comment: CAP - 0603)
C?#11  value 10uF  Voltage: 50V  Package: 0603  [CAP_0603]  (hidden comment: CAP - 0603)
C?#12  value 4.7uF  Voltage: 50V  Package: 0603  [CAP_0603]  (hidden comment: CAP - 0603)
C?#13  value 10uF  Voltage: 50V  Package: 0603  [CAP_0603]  (hidden comment: CAP - 0603)
C?#14  value 10uF  Voltage: 50V  Package: 0603  [CAP_0603]  (hidden comment: CAP - 0603)
C?#15  value 4.7uF  Voltage: 50V  Package: 0603  [CAP_0603]  (hidden comment: CAP - 0603)
C?#16  value 10uF  Voltage: 50V  Package: 0603  [CAP_0603]  (hidden comment: CAP - 0603)
C?#17  value 10uF  Voltage: 50V  Package: 0603  [CAP_0603]  (hidden comment: CAP - 0603)
C?#18  value 1000pF  Voltage: 50V  Package: 0603  [CAP_0603]  (hidden comment: CAP - 0603)
C?#19  value 0.1uF  Voltage: 50V  Package: 0603  [CAP_0603]  (hidden comment: CAP - 0603)
C?#20  value 1000pF  Voltage: 50V  Package: 0603  [CAP_0603]  (hidden comment: CAP - 0603)
C?#21  value 0.1uF  Voltage: 50V  Package: 0603  [CAP_0603]  (hidden comment: CAP - 0603)
R?#6  value 100k  Package: 0603  Precision: 1%  [RES_0603]  (hidden comment: RES - 0603)
R?#7  value 100k  Package: 0603  Precision: 1%  [RES_0603]  (hidden comment: RES - 0603)
R?#8  value 34k  Package: 0603  Precision: 1%  [RES_0603]  (hidden comment: RES - 0603)
R?#9  value 12k  Package: 0603  Precision: 1%  [RES_0603]  (hidden comment: RES - 0603)
R?#10  value 10k  Package: 0603  Precision: 1%  [RES_0603]  (hidden comment: RES - 0603)
R?#11  value 10k  Package: 0603  Precision: 1%  [RES_0603]  (hidden comment: RES - 0603)
R?#12  value 40R  (hidden comment: Resistor)
R?#13  value 40R  (hidden comment: Resistor)
R?#14  value 40R  (hidden comment: Resistor)
R?#15  value 40R  (hidden comment: Resistor)
R?#16  value 40R  (hidden comment: Resistor)
R?#17  value 40R  (hidden comment: Resistor)
R?#18  value 40R  (hidden comment: Resistor)
R?#19  value 40R  (hidden comment: Resistor)
R?#20  value 40R  (hidden comment: Resistor)
R?#21  value 40R  (hidden comment: Resistor)
R?#22  value 40R  (hidden comment: Resistor)
R?#23  value 40R  (hidden comment: Resistor)
R?#24  value 40R  (hidden comment: Resistor)
R?#25  value 40R  (hidden comment: Resistor)
R?#26  value 40R  (hidden comment: Resistor)
R?#27  value 40R  (hidden comment: Resistor)
R?#28  value 40R  (hidden comment: Resistor)
R?#29  value 40R  (hidden comment: Resistor)
R?#30  value 40R  (hidden comment: Resistor)
R?#31  value 40R  (hidden comment: Resistor)
R?#32  value 40R  (hidden comment: Resistor)
R?#33  value 40R  (hidden comment: Resistor)
R?#34  value 40R  (hidden comment: Resistor)
U?#5  TPS51200DRCT  [REG_PMIC_TPS51200DRCT]
U?#6  TPS51200DRCT  [REG_PMIC_TPS51200DRCT]
U?#7  MT41J128M16JT-125  [MEM_DDR3_MT41J128M16JT-125]

### Ports
DDR3_A[0..16] (in, see APP_1_FPGA_e[4B]), DDR3_BA0 (in, see APP_1_FPGA_e[3B]), DDR3_BA1 (in, see APP_1_FPGA_e[3B]), DDR3_BA2 (in, see APP_1_FPGA_e[3B]), DDR3_CAS_N (see APP_1_FPGA_e[3B]), DDR3_CK_N (in, see APP_1_FPGA_e[3B]), DDR3_CK_P (in, see APP_1_FPGA_e[3B]), DDR3_DQ[0..16] (bidir, see APP_1_FPGA_e[4A]), DDR3_LDM, DDR3_LDQS_N, DDR3_LDQS_P, DDR3_ODT (see APP_1_FPGA_e[3B]), DDR3_RAS_N (see APP_1_FPGA_e[3B]), DDR3_UDM (see APP_1_FPGA_e[3B]), DDR3_UDQS_N (see APP_1_FPGA_e[3A]), DDR3_UDQS_P (see APP_1_FPGA_e[3A]), DDR3_WE_N (see APP_1_FPGA_e[3B])

### Nets
3V3: C?#12.2 C?#13.2 C?#14.2 C?#15.2 C?#16.2 C?#17.2 R?#6.2 R?#7.2 R?#8.2 R?#9.2 U?#5.2(VLDOIN) U?#5.7(EN) U?#5.10(VIN) U?#6.2(VLDOIN) U?#6.7(EN) U?#6.10(VIN)
DDR3_0V75: C?#4.2 C?#5.2 C?#6.2 C?#7.1 C?#8.1 R?#12.2 R?#13.2 R?#14.2 R?#15.2 R?#16.2 R?#17.2 R?#18.2 R?#19.2 R?#20.2 R?#21.2 R?#22.2 R?#23.2 R?#24.2 R?#25.2 R?#26.2 R?#27.2 R?#28.2 U?#5.3(VO) U?#5.5(VOSNS)
DDR3_1V5: C?#9.2 C?#10.2 C?#11.2 U?#6.3(VO) U?#6.5(VOSNS) U?#7.A1(VDDQ) U?#7.A8(VDDQ) U?#7.B2(VDD) U?#7.C1(VDDQ) U?#7.C9(VDDQ) U?#7.D2(VDDQ) U?#7.D9(VDD) U?#7.E9(VDDQ) U?#7.F1(VDDQ) U?#7.G7(VDD) U?#7.H2(VDDQ) U?#7.H9(VDDQ) U?#7.K2(VDD) U?#7.K8(VDD) U?#7.N1(VDD) U?#7.N9(VDD) U?#7.R1(VDD) U?#7.R9(VDD)
DDR3_VTT: R?#31.2 R?#32.2 R?#33.2 R?#34.2
GND: C?#4.1 C?#5.1 C?#6.1 C?#7.2 C?#8.2 C?#9.1 C?#10.1 C?#11.1 C?#12.1 C?#13.1 C?#14.1 C?#15.1 C?#16.1 C?#17.1 C?#18.1 C?#19.1 C?#20.1 C?#21.1 R?#10.1 R?#11.1 R?#29.1 R?#30.2 U?#5.4(PGND) U?#5.8(GND) U?#5.11(EP) U?#6.4(PGND) U?#6.8(GND) U?#6.11(EP) U?#7.A9(VSS) U?#7.B1(VSSQ) U?#7.B3(VSS) U?#7.B9(VSSQ) U?#7.D1(VSSQ) U?#7.D8(VSSQ) U?#7.E1(VSS) U?#7.E2(VSSQ) U?#7.E8(VSSQ) U?#7.F9(VSSQ) U?#7.G1(VSSQ) U?#7.G8(VSS) U?#7.G9(VSSQ) U?#7.J2(VSS) U?#7.J8(VSS) U?#7.L2(~{CS}) U?#7.M1(VSS) U?#7.M9(VSS) U?#7.P1(VSS) U?#7.P9(VSS) U?#7.T1(VSS) U?#7.T9(VSS)
DDR3_A0: R?#12.1 U?#7.N3(A0)
DDR3_A1: R?#13.1 U?#7.P7(A1)
DDR3_A2: R?#14.1 U?#7.P3(A2)
DDR3_A3: R?#15.1 U?#7.N2(A3)
DDR3_A4: R?#16.1 U?#7.P8(A4)
DDR3_A5: R?#17.1 U?#7.P2(A5)
DDR3_A6: R?#18.1 U?#7.R8(A6)
DDR3_A7: R?#19.1 U?#7.R2(A7)
DDR3_A8: R?#20.1 U?#7.T8(A8)
DDR3_A9: R?#21.1 U?#7.R3(A9)
DDR3_A10: R?#22.1 U?#7.L7(A10/AP)
DDR3_A11: R?#23.1 U?#7.R7(A11)
DDR3_A12: R?#24.1 U?#7.N7(A12/BC#)
DDR3_A13: R?#25.1 U?#7.T3(A13)
DDR3_BA0: R?#26.1 U?#7.M2(BA0) ; port DDR3_BA0
DDR3_BA1: R?#27.1 U?#7.N8(BA1) ; port DDR3_BA1
DDR3_BA2: R?#28.1 U?#7.M3(BA2) ; port DDR3_BA2
DDR3_CAS_N: R?#32.1 U?#7.K3(~{CAS}) ; port DDR3_CAS_N
DDR3_CK_N: R?#30.1 U?#7.K7(~{CK}) ; port DDR3_CK_N
DDR3_CK_P: R?#29.2 U?#7.J7(CK) ; port DDR3_CK_P
DDR3_DQ0: U?#7.E3(DQ0)
DDR3_DQ1: U?#7.F7(DQ1)
DDR3_DQ2: U?#7.F2(DQ2)
DDR3_DQ3: U?#7.F8(DQ3)
DDR3_DQ4: U?#7.H3(DQ4)
DDR3_DQ5: U?#7.H8(DQ5)
DDR3_DQ6: U?#7.G2(DQ6)
DDR3_DQ7: U?#7.H7(DQ7)
DDR3_DQ8: U?#7.D7(DQ8)
DDR3_DQ9: U?#7.C3(DQ9)
DDR3_DQ10: U?#7.C8(DQ10)
DDR3_DQ11: U?#7.C2(DQ11)
DDR3_DQ12: U?#7.A7(DQ12)
DDR3_DQ13: U?#7.A2(DQ13)
DDR3_DQ14: U?#7.B8(DQ14)
DDR3_DQ15: U?#7.A3(DQ15)
DDR3_LDM: U?#7.E7(LDM) ; port DDR3_LDM
DDR3_LDQS_N: U?#7.G3(~{LDQS}) ; port DDR3_LDQS_N
DDR3_LDQS_P: U?#7.F3(LDQS) ; port DDR3_LDQS_P
DDR3_ODT: R?#34.1 U?#7.K1(ODT) ; port DDR3_ODT
DDR3_RAS_N: R?#31.1 U?#7.J3(~{RAS}) ; port DDR3_RAS_N
DDR3_UDM: U?#7.D3(UDM) ; port DDR3_UDM
DDR3_UDQS_N: U?#7.B7(~{UDQS}) ; port DDR3_UDQS_N
DDR3_UDQS_P: U?#7.C7(UDQS) ; port DDR3_UDQS_P
DDR3_WE_N: R?#33.1 U?#7.L3(~{WE}) ; port DDR3_WE_N
NetC?#18_2: C?#18.2 R?#8.1 R?#10.2 U?#5.1(REFIN)
NetC?#19_2: C?#19.2 U?#5.6(REFOUT)
NetC?#20_2: C?#20.2 R?#9.1 R?#11.2 U?#6.1(REFIN)
NetC?#21_2: C?#21.2 U?#6.6(REFOUT)
NetR?#6_1: R?#6.1 U?#5.9(PGOOD)
NetR?#7_1: R?#7.1 U?#6.9(PGOOD)

Not connected (* = marked no-connect by the designer): U?#7 H1(VREFDQ) J1(NC)* J9(NC)* K9(CKE) L1(NC)* L8(ZQ) L9(NC)* M7(NC)* M8(VREFCA) T2(~{RESET}) T7(NC)*

### Layout directives
differential pair: DDR3_CK_N, DDR3_CK_P, DDR3_LDQS_N, DDR3_LDQS_P, DDR3_UDQS_N, DDR3_UDQS_P

### Notes on the sheet
- DDR3_VTT =  0.75V
- Utiliser la moitier des condo de sortie en entrée
- (near R?#20) Terminaison a 40R, Standard DDR3. SSTL15_II
- DDR3 : 1.5V, 40ohms impedance .Terminer à 1.5V/2 avec le TPS
  Current Consomption : standby ~ 250mA
- Sheet Name
- Project Title
- Global Project
- Size
- Group
- Revision
- Date
- Sheet
- of
- Filename
- Designers
- (in symbol MEM_DDR3_MT41J128M16JT-125:K TR) DDR3 SDRAM

### Library data of the parts
C?#4-C?#6 C?#9-C?#21 = CAP - 0603: Precision: 10%; Current: *; CreatedBy: Jonathan Bouchard; Power: *
C?#7 C?#8 = CAP_ALU_MAL215099101E3: CAP - ALU 100uF 20% 50V - 1010; Current: 490mA; Mfg: Vishay Dale; Mfg Part Number: MAL215099101E3; HelpURL: http://www.vishay.com/docs/28395/150crz.pdf; CreatedBy: Jonathan Bouchard; Temperature: -55°C to 125°C; Power: *; Supplier 1: Digikey; Supplier Part Number 1: 4399PHDKR-ND
R?#12-R?#34 = Resistor: TC1: 0; SimulationGenericComponent: True; TC2: 0
U?#5 U?#6 = REG_PMIC_TPS51200DRCT: REG - DDR TERMINATION/REF REG - 10-VFDFN; Manufacturer #1: Texas Instruments; Value: DDR, DDR2, DDR3(L), DDR4; Voltage Rating: 2.375V ~ 3.5V; Current Rating: Source: 3A~4.5A, Sink: 3.5A~5.5A; GRAMS Lib Spec: 2.8; Magnetic Material: Unknown; Polarized: Yes; Tolerance: *; Power Max: *; HelpURL: http://www.ti.com/lit/ds/symlink/tps51200.pdf; CreatedBy/Date: Joel Lemay 2019-03-19; VerifiedBy: Nicolas V. (2019-05-31); Temperature: -40°C ~ 85°C; Package: 10-VFDFN; Manufacturer #2: *; Note: *; Assembly Type: SMD; Part Number #2: *; Part Number #1: TPS51200DRCT; Supplier 1: Digi-Key; Supplier Part Number 1: 296-23830-1-ND; Cryo: UNKNOWN
U?#7 = MEM_DDR3_MT41J128M16JT-125:K TR: MEM - DDR3 SDRAM 2GBIT 800MHZ - TFBGA-96; Voltage: 1.425 V ~ 1.575 V; Mfg: Micrel; Current: *; Power: *; Mfg Part Number: MT41J128M16JT-125; HelpURL: http://www.micron.com/~/media/Documents/Products/Data%20Sheet/DRAM/DDR3/2Gb_DDR3_SDRAM.pdf; CreatedBy: Jonathan Bouchard; Temperature: 0°C ~ 95°C (TC); Value: *; Precision: *; Package: TFBGA-96; Supplier 1: Digikey; Supplier Part Number 1: 557-1611-1-ND
R?#6-R?#11 = RES - 0603: Current: *; CreatedBy: Jonathan Bouchard

## Sheet APP_1_Prog.SchDoc
size Tabloid; SheetNumber: 6; SheetTotal: 13; Sheet_Name: Prog; Size: 11x17
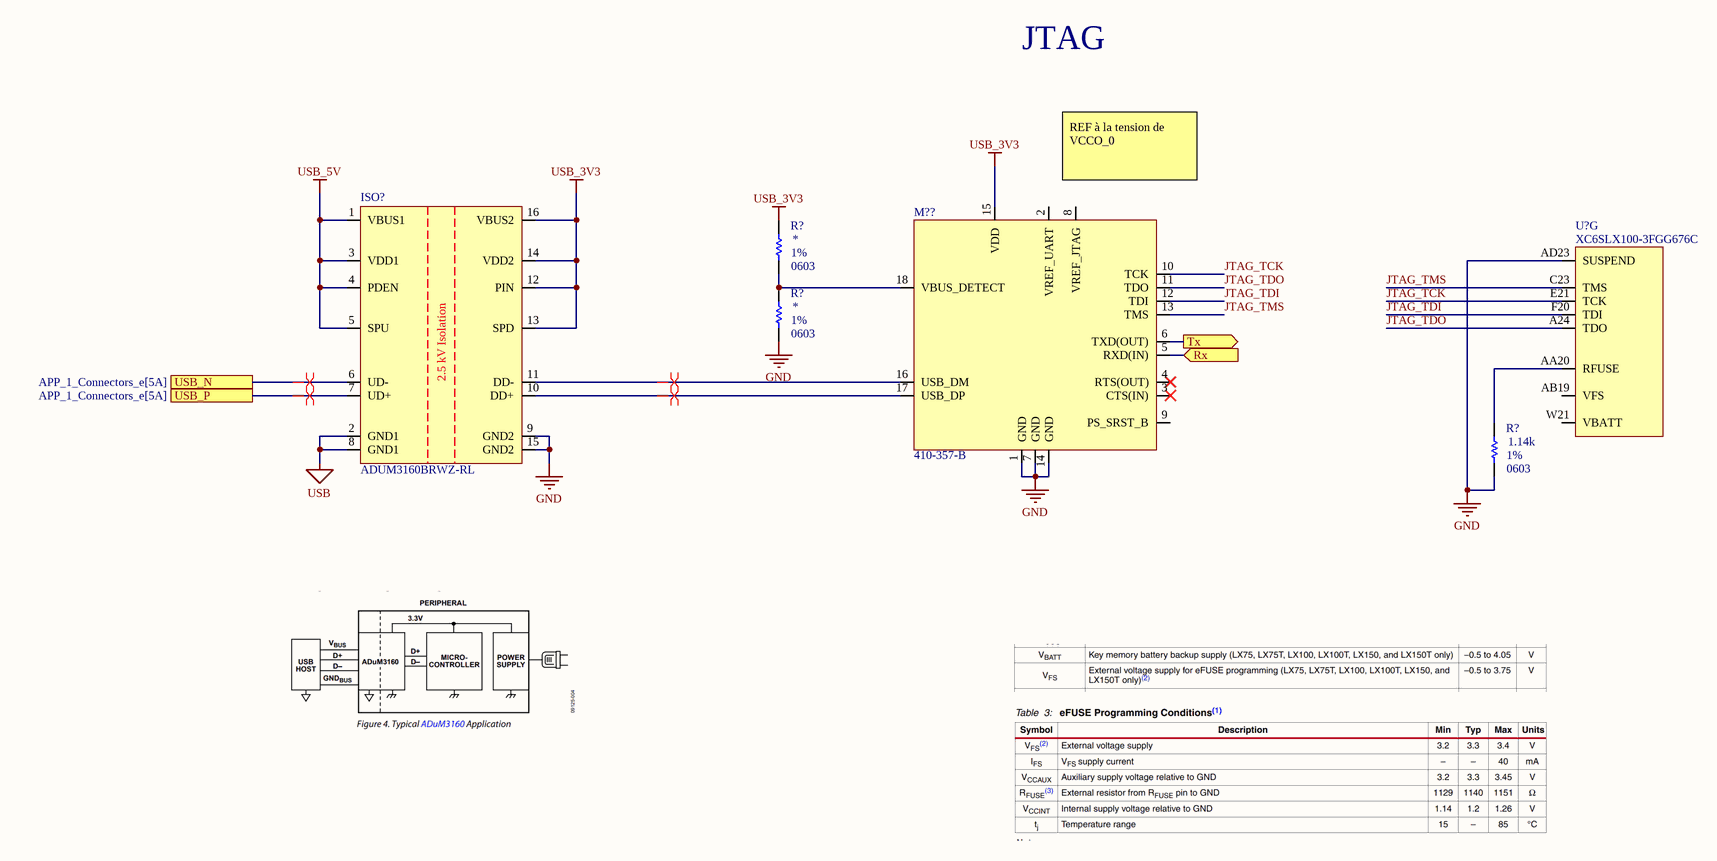
[diagram p4: APP_1_Prog.SchDoc]

### Parts
(Parts that share a designator on the sheet are numbered #1, #2 ... from top to bottom, then left to right.)
ISO?  ADUM3160BRWZ-RL  [ISO_ADUM3160BRWZ-RL]
M??  410-357-B  [MOD_JTAG_410-357-B]
R?#35  Package: 0603  Precision: 1%  [RES_0603]  (hidden comment: RES - 0603)
R?#36  Package: 0603  Precision: 1%  [RES_0603]  (hidden comment: RES - 0603)
R?#37  value 1.14k  Package: 0603  Precision: 1%  [RES_0603]  (hidden comment: RES - 0603)
U?#8  XC6SLX100-3FGG676C  [FPGA_XILINX_FGG676]  (part G of 10)

### Ports
Rx (in), Tx (out), USB_N (see APP_1_Connectors_e[5A]), USB_P (see APP_1_Connectors_e[5A])

### Nets
GND: ISO?.9(GND2) ISO?.15(GND2) M??.1(GND) M??.7(GND) M??.14(GND) R?#36.1 R?#37.1 U?#8.AD23(SUSPEND)
USB: ISO?.2(GND1) ISO?.8(GND1)
USB_3V3: ISO?.12(PIN) ISO?.13(SPD) ISO?.14(VDD2) ISO?.16(VBUS2) M??.15(VDD) R?#35.2
USB_5V: ISO?.1(VBUS1) ISO?.3(VDD1) ISO?.4(PDEN) ISO?.5(SPU)
JTAG_TCK: M??.10(TCK) U?#8.E21(TCK)
JTAG_TDI: M??.12(TDI) U?#8.F20(TDI)
JTAG_TDO: M??.11(TDO) U?#8.A24(TDO)
JTAG_TMS: M??.13(TMS) U?#8.C23(TMS)
Rx: M??.5(RXD(IN)) ; port Rx
Tx: M??.6(TXD(OUT)) ; port Tx
USB_N: ISO?.6(UD-) ; port USB_N
USB_P: ISO?.7(UD+) ; port USB_P
NetISO?_10: ISO?.10(DD+) M??.17(USB_DP)
NetISO?_11: ISO?.11(DD-) M??.16(USB_DM)
NetM??_18: M??.18(VBUS_DETECT) R?#35.1 R?#36.2
NetR?#37_2: R?#37.2 U?#8.AA20(RFUSE)

Not connected (* = marked no-connect by the designer): M?? 2(VREF_UART) 3(CTS(IN))* 4(RTS(OUT))* 8(VREF_JTAG) 9(PS_SRST_B); U?#8 AB19(VFS) W21(VBATT)

### Layout directives
differential pair: NetISO?_10, NetISO?_11, USB_N, USB_P

### Notes on the sheet
- JTAG
- (near M??) REF à la tension de VCCO_0
- Sheet Name
- Project Title
- Global Project
- Size
- Group
- Revision
- Date
- Sheet
- of
- Filename
- Designers
- (in symbol ISO_ADUM3160BRWZ-RL) 2.5 kV Isolation

### Library data of the parts
ISO? = ISO_ADUM3160BRWZ-RL: ISO - DGTL ISO 2.5KV 2CH USB - 16SOIC; Manufacturer #1: Analog Devices; Value: 2500Vrms voltage isolation; Voltage Rating: 3~5.5V; GRAMS Lib Spec: 2.8; Magnetic Material: UNKNOWN; Polarized: Yes; Tolerance: *; Current Rating: *; Power Max: *; HelpURL: https://www.analog.com/media/en/technical-documentation/data-sheets/ADuM3160.pdf; CreatedBy/Date: Tommy Rossignol 2018-11-16; VerifiedBy: Caroline Paulin - 13 février 2019; Temperature: -40°C ~ 105°C; Package: 16-SOIC; Manufacturer #2: *; Assembly Type: SMD; Part Number #2: *; Part Number #1: ADUM3160BRWZ-RL; Supplier 1: Digi-Key; Supplier Part Number 1: ADUM3160BRWZ-RLCT-ND; Cryo: UNKNOWN
M?? = MOD_JTAG_410-357-B: MOD - JTAG-SMT3-NC Programming Module For Xilinx FPGA - 18-SMT; Manufacturer #1: Digilent; Voltage Rating: VDD: 2.97V~3.63V, VJTAG/VUART: 1.65V~5.5V; GRAMS Lib Spec: 2.8; Note: Prior to reflow, the JTAG-SMT3-NC module must be dried at 125°C for 17 hours; Magnetic Material: Unknown; Polarized: Yes; Value: *; Tolerance: *; Current Rating: *; Power Max: *; HelpURL: https://reference.digilentinc.com/_media/reference/programmers/jtag-smt3/jtag-smt3-nc_rm.pdf; CreatedBy/Date: Tommy Rossignol 2018-11-23; VerifiedBy: Nicolas V. (2019-01-28); Temperature: -40°C ~ 85°C; Package: 18-pad SMT; Manufacturer #2: *; Assembly Type: SMD; Part Number #2: *; Part Number #1: 410-357-B; Supplier 1: Digi-Key; Supplier Part Number 1: 1286-1196-ND; Cryo: UNKNOWN
U?#8 = FPGA_XC6SLX100-3FGG676C: as U?#1 on sheet APP_1_FPGA_e; Current: *; Power: *; Mfg: Xilinx; Mfg Part Number: XC6SLX100-3FGG676C; HelpURL: https://www.xilinx.com/support/documentation/data_sheets/ds162.pdf; CreatedBy: Jonathan Bouchard; Temperature: 0°C ~ 85°C (TJ); Value: *; Precision: *; Package: BGA-676; Supplier 1: Digikey; Supplier Part Number 1: 122-1760-ND
R?#35-R?#37 = RES - 0603: Current: *; CreatedBy: Jonathan Bouchard
  R?#35 R?#36: Value: *

## Sheet APP_1_Stepper.SchDoc
size Tabloid; SheetNumber: 8; SheetTotal: 10; Sheet_Name: Insert name in Document Parameters; Size: 11x17
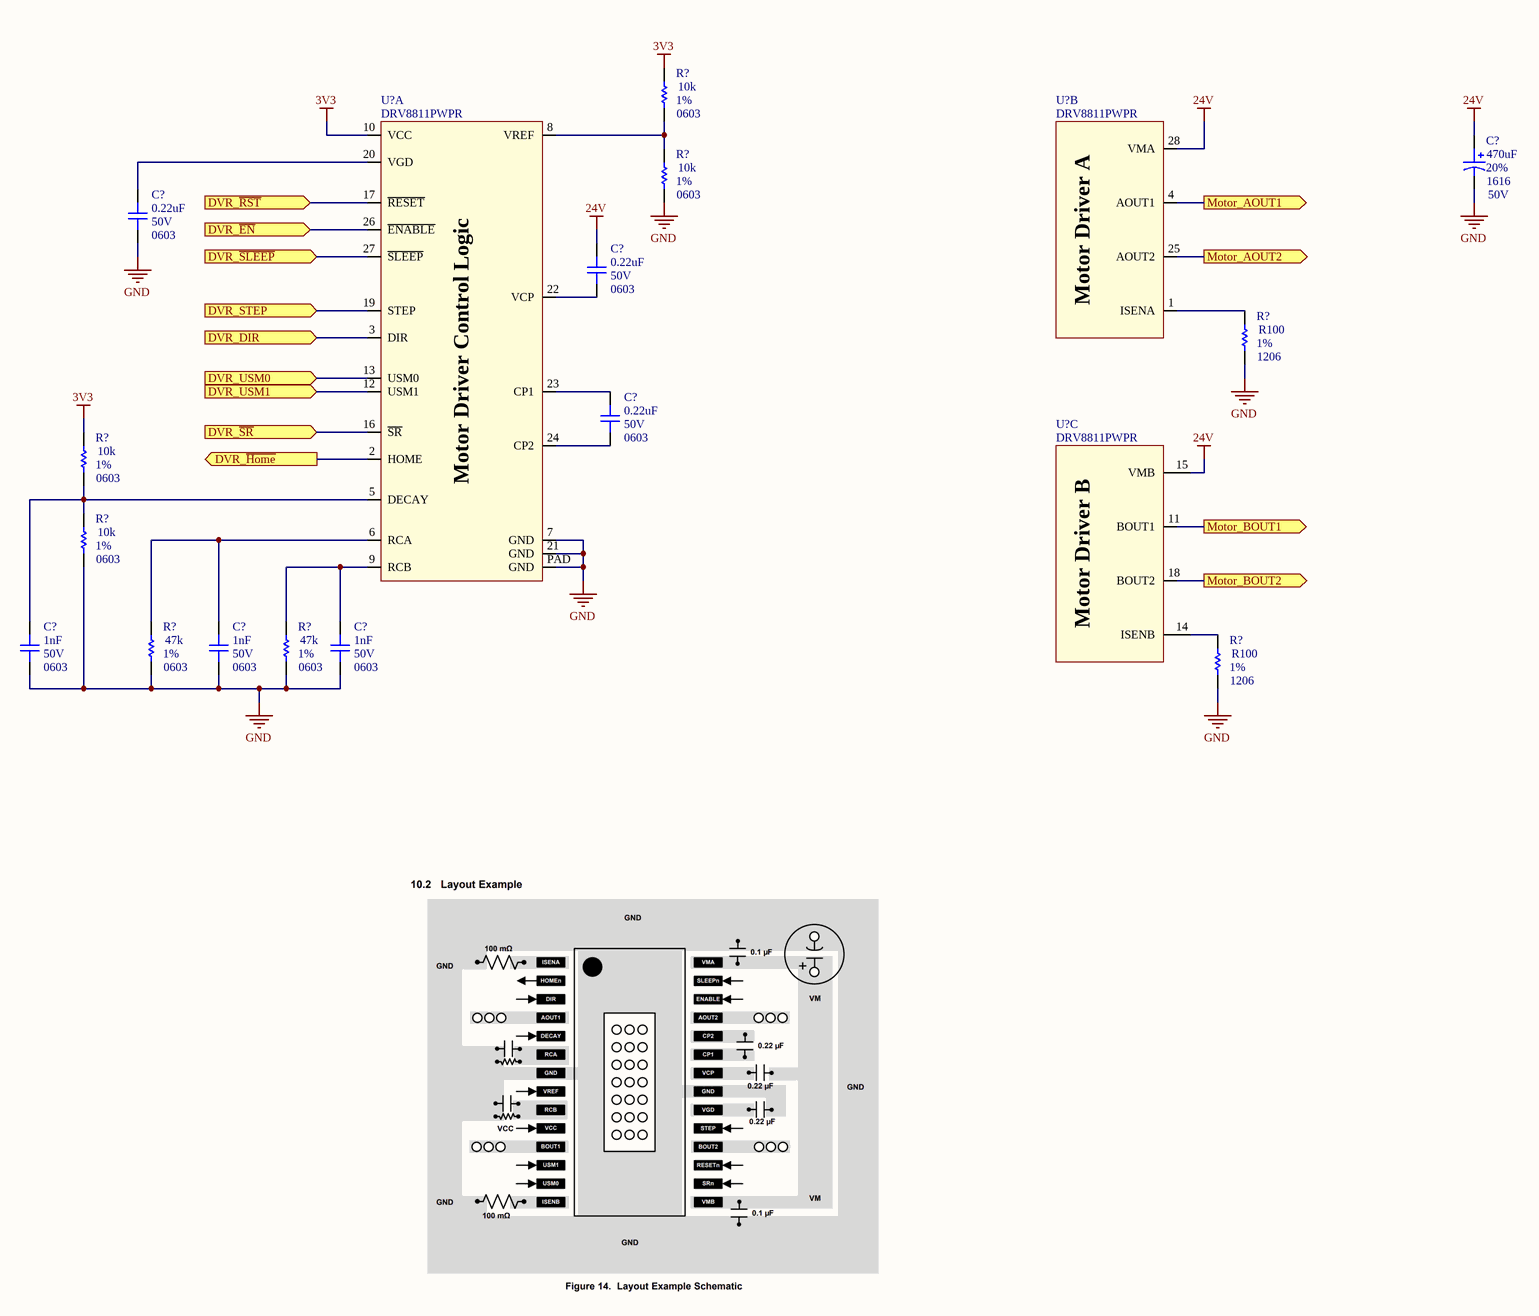
[diagram p5: APP_1_Stepper.SchDoc]

### Parts
(Parts that share a designator on the sheet are numbered #1, #2 ... from top to bottom, then left to right.)
C?#22  value 470uF  Voltage: 50V  Package: 1616  Precision: 20%  [CAP_ALU_1616_vishay]  (hidden comment: MAL214699108E3)
C?#23  value 0.22uF  Voltage: 50V  Package: 0603  [CAP_0603]  (hidden comment: CAP - 0603)
C?#24  value 0.22uF  Voltage: 50V  Package: 0603  [CAP_0603]  (hidden comment: CAP - 0603)
C?#25  value 0.22uF  Voltage: 50V  Package: 0603  [CAP_0603]  (hidden comment: CAP - 0603)
C?#26  value 1nF  Voltage: 50V  Package: 0603  [CAP_0603]  (hidden comment: CAP - 0603)
C?#27  value 1nF  Voltage: 50V  Package: 0603  [CAP_0603]  (hidden comment: CAP - 0603)
C?#28  value 1nF  Voltage: 50V  Package: 0603  [CAP_0603]  (hidden comment: CAP - 0603)
R?#38  value 10k  Package: 0603  Precision: 1%  [RES_0603]  (hidden comment: RES - 0603)
R?#39  value 10k  Package: 0603  Precision: 1%  [RES_0603]  (hidden comment: RES - 0603)
R?#40  value R100  Package: 1206  Precision: 1%  [RES_1206]  (hidden comment: RES - 1206)
R?#41  value 10k  Package: 0603  Precision: 1%  [RES_0603]  (hidden comment: RES - 0603)
R?#42  value 10k  Package: 0603  Precision: 1%  [RES_0603]  (hidden comment: RES - 0603)
R?#43  value 47k  Package: 0603  Precision: 1%  [RES_0603]  (hidden comment: RES - 0603)
R?#44  value 47k  Package: 0603  Precision: 1%  [RES_0603]  (hidden comment: RES - 0603)
R?#45  value R100  Package: 1206  Precision: 1%  [RES_1206]  (hidden comment: RES - 1206)
U?#9  DRV8811PWPR  [POW_MOTOR_DRV8811PWPR]  (part A of 3)
U?#10  DRV8811PWPR  [POW_MOTOR_DRV8811PWPR]  (part B of 3)
U?#11  DRV8811PWPR  [POW_MOTOR_DRV8811PWPR]  (part C of 3)

### Ports
DVR_DIR (in), DVR_STEP (in), DVR_USM0 (in), DVR_USM1 (in), DVR_~{EN} (in), DVR_~{Home} (out), DVR_~{RST} (in), DVR_~{SLEEP} (in), DVR_~{SR} (in), Motor_AOUT1 (out), Motor_AOUT2 (out), Motor_BOUT1 (out), Motor_BOUT2 (out)

### Nets
3V3: R?#38.2 R?#41.2 U?#9.10(VCC)
24V: C?#22.1 C?#24.2 U?#10.28(VMA) U?#11.15(VMB)
GND: C?#22.2 C?#23.1 C?#26.1 C?#27.1 C?#28.1 R?#39.1 R?#40.1 R?#42.1 R?#43.1 R?#44.1 R?#45.1 U?#9.7(GND) U?#9.21(GND) U?#9.PAD(GND)
DVR_DIR: U?#9.3(DIR) ; port DVR_DIR
DVR_~{EN}: U?#9.26(~{ENABLE}) ; port DVR_~{EN}
DVR_~{Home}: U?#9.2(HOME) ; port DVR_~{Home}
DVR_~{RST}: U?#9.17(~{RESET}) ; port DVR_~{RST}
DVR_~{SLEEP}: U?#9.27(~{SLEEP}) ; port DVR_~{SLEEP}
DVR_~{SR}: U?#9.16(~{SR}) ; port DVR_~{SR}
DVR_STEP: U?#9.19(STEP) ; port DVR_STEP
DVR_USM0: U?#9.13(USM0) ; port DVR_USM0
DVR_USM1: U?#9.12(USM1) ; port DVR_USM1
Motor_AOUT1: U?#10.4(AOUT1) ; port Motor_AOUT1
Motor_AOUT2: U?#10.25(AOUT2) ; port Motor_AOUT2
Motor_BOUT1: U?#11.11(BOUT1) ; port Motor_BOUT1
Motor_BOUT2: U?#11.18(BOUT2) ; port Motor_BOUT2
NetC?#23_2: C?#23.2 U?#9.20(VGD)
NetC?#24_1: C?#24.1 U?#9.22(VCP)
NetC?#25_1: C?#25.1 U?#9.24(CP2)
NetC?#25_2: C?#25.2 U?#9.23(CP1)
NetC?#26_2: C?#26.2 R?#41.1 R?#42.2 U?#9.5(DECAY)
NetC?#27_2: C?#27.2 R?#43.2 U?#9.6(RCA)
NetC?#28_2: C?#28.2 R?#44.2 U?#9.9(RCB)
NetR?#38_1: R?#38.1 R?#39.2 U?#9.8(VREF)
NetR?#40_2: R?#40.2 U?#10.1(ISENA)
NetR?#45_2: R?#45.2 U?#11.14(ISENB)

### Notes on the sheet
- Sheet Name
- Project Title
- Global Project
- Size
- Group
- Revision
- Date
- Sheet
- of
- Filename
- Designers
- (in symbol POW_MOTOR_DRV8811PWPR, part A) Motor Driver Control Logic
- (in symbol POW_MOTOR_DRV8811PWPR, part B) Motor Driver A
- (in symbol POW_MOTOR_DRV8811PWPR, part C) Motor Driver B

### Library data of the parts
C?#22 = CAP_ALU_MAL214699108E3: CAP - ALU 470uF 20% 50V - 1616; Current: 1.3A; Mfg: Vishay Dale; Mfg Part Number: MAL214699108E3; HelpURL: http://www.vishay.com/docs/28403/146cti.pdf; CreatedBy: Jonathan Bouchard; Temperature: -55°C to 125°C; Power: *; Supplier 1: Digikey; Supplier Part Number 1: 4442PHCT-ND
C?#23-C?#28 = CAP - 0603: Precision: 10%; Current: *; CreatedBy: Jonathan Bouchard; Power: *
U?#9-U?#11 = POW_MOTOR_DRV8811PWPR: POW - STEPPER MOTOR DRIVER - SOP-28; Voltage: 3 V ~ 5.5 V / 8 V ~ 38 V; Mfg: Texas Instrument; Current: *; Power: *; Mfg Part Number: DRV8811PWPR; HelpURL: http://www.ti.com/lit/ds/symlink/drv8811.pdf; CreatedBy: Jonathan Bouchard; Temperature: -40°C ~ 150°C (TJ); Value: *; Precision: *; Package: SOP-28; Supplier 1: Digikey; Supplier Part Number 1: 296-24591-1-ND
R?#38 R?#39 R?#41-R?#44 = RES - 0603: Current: *; CreatedBy: Jonathan Bouchard
R?#40 R?#45 = RES - 1206: Current: *; CreatedBy: Jonathan Bouchard

## Sheet APP_1_DAC.SchDoc
size Tabloid; SheetNumber: 8; SheetTotal: 13; Sheet_Name: DAC; Size: 11x17
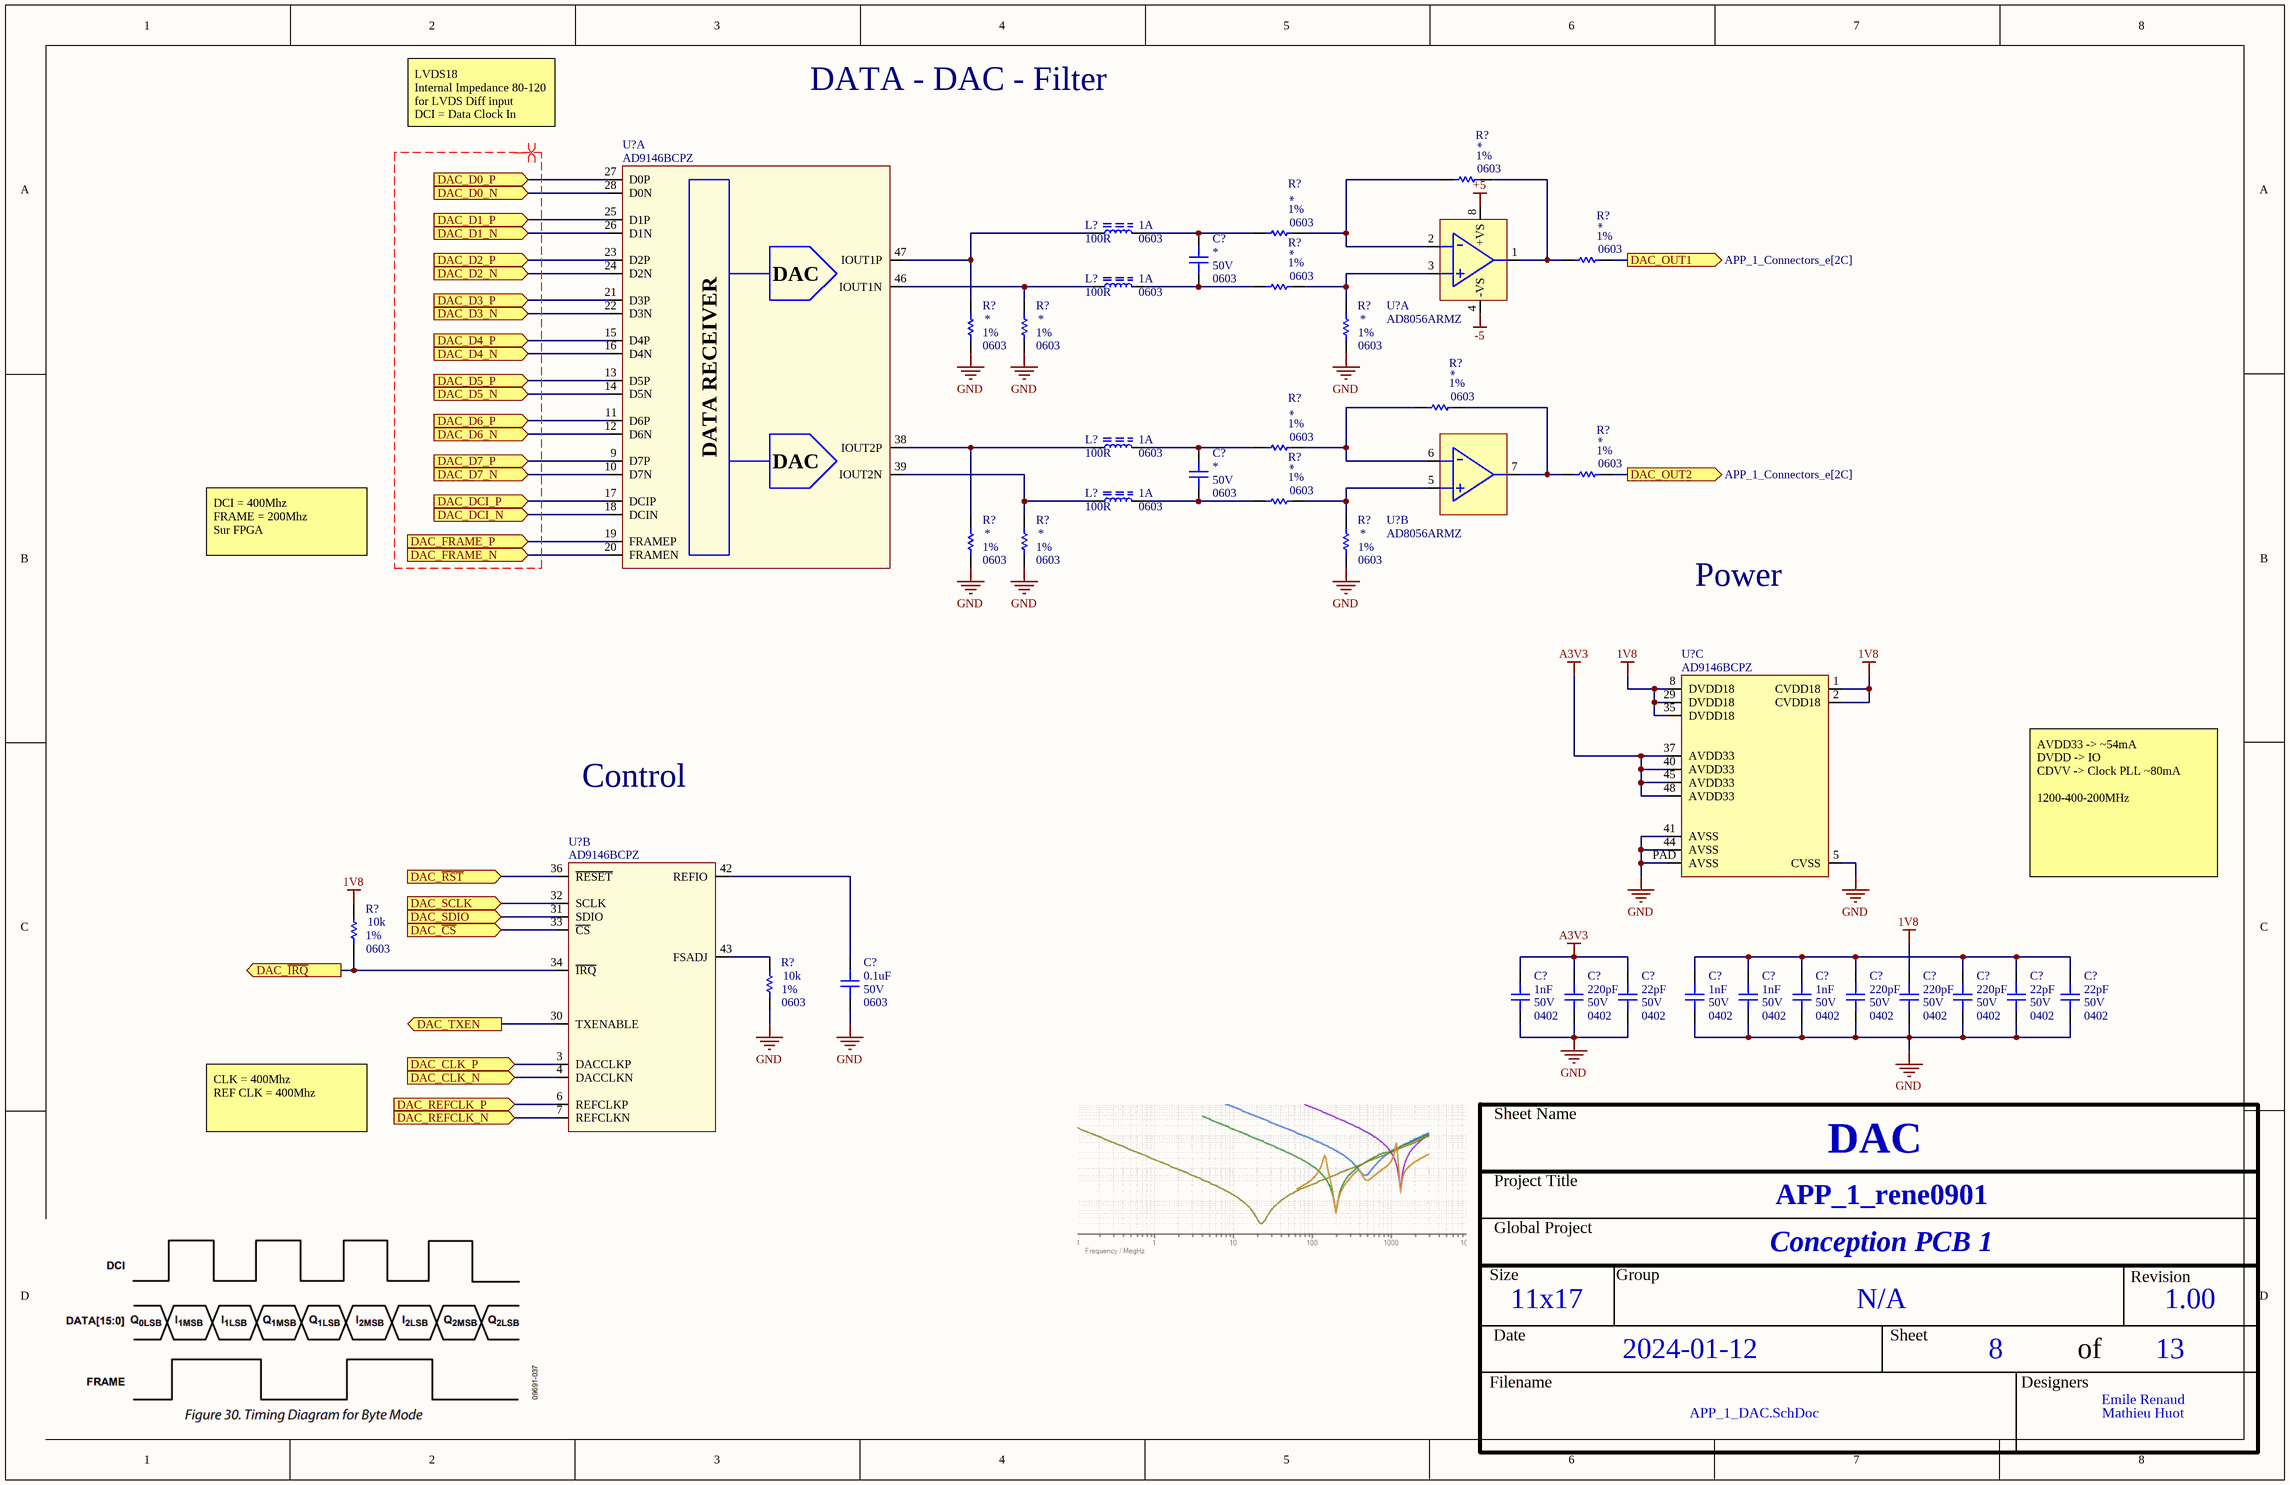
[diagram p6: APP_1_DAC.SchDoc]

### Parts
(Parts that share a designator on the sheet are numbered #1, #2 ... from top to bottom, then left to right.)
C?#29  Voltage: 50V  Package: 0603  [CAP_0603]  (hidden comment: CAP - 0603)
C?#30  Voltage: 50V  Package: 0603  [CAP_0603]  (hidden comment: CAP - 0603)
C?#31  value 0.1uF  Voltage: 50V  Package: 0603  [CAP_0603]  (hidden comment: CAP - 0603)
C?#32  value 1nF  Voltage: 50V  Package: 0402  [CAP_0402]  (hidden comment: CAP - 0402)
C?#33  value 220pF  Voltage: 50V  Package: 0402  [CAP_0402]  (hidden comment: CAP - 0402)
C?#34  value 22pF  Voltage: 50V  Package: 0402  [CAP_0402]  (hidden comment: CAP - 0402)
C?#35  value 1nF  Voltage: 50V  Package: 0402  [CAP_0402]  (hidden comment: CAP - 0402)
C?#36  value 1nF  Voltage: 50V  Package: 0402  [CAP_0402]  (hidden comment: CAP - 0402)
C?#37  value 1nF  Voltage: 50V  Package: 0402  [CAP_0402]  (hidden comment: CAP - 0402)
C?#38  value 220pF  Voltage: 50V  Package: 0402  [CAP_0402]  (hidden comment: CAP - 0402)
C?#39  value 220pF  Voltage: 50V  Package: 0402  [CAP_0402]  (hidden comment: CAP - 0402)
C?#40  value 220pF  Voltage: 50V  Package: 0402  [CAP_0402]  (hidden comment: CAP - 0402)
C?#41  value 22pF  Voltage: 50V  Package: 0402  [CAP_0402]  (hidden comment: CAP - 0402)
C?#42  value 22pF  Voltage: 50V  Package: 0402  [CAP_0402]  (hidden comment: CAP - 0402)
L?#2  value 100R  Current: 1A  Package: 0603  [FER_0603]  (hidden comment: FER - 0603)
L?#3  value 100R  Current: 1A  Package: 0603  [FER_0603]  (hidden comment: FER - 0603)
L?#4  value 100R  Current: 1A  Package: 0603  [FER_0603]  (hidden comment: FER - 0603)
L?#5  value 100R  Current: 1A  Package: 0603  [FER_0603]  (hidden comment: FER - 0603)
R?#46  Package: 0603  Precision: 1%  [RES_0603]  (hidden comment: RES - 0603)
R?#47  Package: 0603  Precision: 1%  [RES_0603]  (hidden comment: RES - 0603)
R?#48  Package: 0603  Precision: 1%  [RES_0603]  (hidden comment: RES - 0603)
R?#49  Package: 0603  Precision: 1%  [RES_0603]  (hidden comment: RES - 0603)
R?#50  Package: 0603  Precision: 1%  [RES_0603]  (hidden comment: RES - 0603)
R?#51  Package: 0603  Precision: 1%  [RES_0603]  (hidden comment: RES - 0603)
R?#52  Package: 0603  Precision: 1%  [RES_0603]  (hidden comment: RES - 0603)
R?#53  Package: 0603  Precision: 1%  [RES_0603]  (hidden comment: RES - 0603)
R?#54  Package: 0603  Precision: 1%  [RES_0603]  (hidden comment: RES - 0603)
R?#55  Package: 0603  Precision: 1%  [RES_0603]  (hidden comment: RES - 0603)
R?#56  Package: 0603  Precision: 1%  [RES_0603]  (hidden comment: RES - 0603)
R?#57  Package: 0603  Precision: 1%  [RES_0603]  (hidden comment: RES - 0603)
R?#58  Package: 0603  Precision: 1%  [RES_0603]  (hidden comment: RES - 0603)
R?#59  Package: 0603  Precision: 1%  [RES_0603]  (hidden comment: RES - 0603)
R?#60  value 10k  Package: 0603  Precision: 1%  [RES_0603]  (hidden comment: RES - 0603)
R?#61  value 10k  Package: 0603  Precision: 1%  [RES_0603]  (hidden comment: RES - 0603)
U?#12  AD9146BCPZ  [DAC_AD9146BCPZ]  (part A of 3)
U?#13  AD8056ARMZ  [OPAMP_AD8056ARMZ]  (part A of 2)
U?#14  AD8056ARMZ  [OPAMP_AD8056ARMZ]  (part B of 2)
U?#15  AD9146BCPZ  [DAC_AD9146BCPZ]  (part C of 3)
U?#16  AD9146BCPZ  [DAC_AD9146BCPZ]  (part B of 3)

### Ports
DAC_CLK_N (in), DAC_CLK_P (in), DAC_D0_N (in), DAC_D0_P (in), DAC_D1_N (in), DAC_D1_P (in), DAC_D2_N (in), DAC_D2_P (in), DAC_D3_N (in), DAC_D3_P (in), DAC_D4_N (in), DAC_D4_P (in), DAC_D5_N (in), DAC_D5_P (in), DAC_D6_N (in), DAC_D6_P (in), DAC_D7_N (in), DAC_D7_P (in), DAC_DCI_N (in), DAC_DCI_P (in), DAC_FRAME_N (in), DAC_FRAME_P (in), DAC_OUT1 (out, see APP_1_Connectors_e[2C]), DAC_OUT2 (out, see APP_1_Connectors_e[2C]), DAC_REFCLK_N (in), DAC_REFCLK_P (in), DAC_SCLK (in), DAC_SDIO (in), DAC_TXEN (out), DAC_~{CS} (in), DAC_~{IRQ} (out), DAC_~{RST} (in)

### Nets
1V8: C?#39.2 R?#60.2 U?#15.1(CVDD18) U?#15.2(CVDD18) U?#15.8(DVDD18) U?#15.29(DVDD18) U?#15.35(DVDD18)
+5: U?#13.8(+VS)
-5: U?#13.4(-VS)
A3V3: C?#32.2 C?#33.2 C?#34.2 U?#15.37(AVDD33) U?#15.40(AVDD33) U?#15.45(AVDD33) U?#15.48(AVDD33)
GND: C?#31.1 C?#32.1 C?#33.1 C?#34.1 C?#35.1 C?#36.1 C?#37.1 C?#38.1 C?#39.1 C?#40.1 C?#41.1 C?#42.1 R?#50.1 R?#51.1 R?#52.1 R?#57.1 R?#58.1 R?#59.1 R?#61.1 U?#15.5(CVSS) U?#15.41(AVSS) U?#15.44(AVSS) U?#15.PAD(AVSS)
DAC_~{CS}: U?#16.33(~{CS}) ; port DAC_~{CS}
DAC_CLK_N: U?#16.4(DACCLKN) ; port DAC_CLK_N
DAC_CLK_P: U?#16.3(DACCLKP) ; port DAC_CLK_P
DAC_D0_N: U?#12.28(D0N) ; port DAC_D0_N
DAC_D0_P: U?#12.27(D0P) ; port DAC_D0_P
DAC_D1_N: U?#12.26(D1N) ; port DAC_D1_N
DAC_D1_P: U?#12.25(D1P) ; port DAC_D1_P
DAC_D2_N: U?#12.24(D2N) ; port DAC_D2_N
DAC_D2_P: U?#12.23(D2P) ; port DAC_D2_P
DAC_D3_N: U?#12.22(D3N) ; port DAC_D3_N
DAC_D3_P: U?#12.21(D3P) ; port DAC_D3_P
DAC_D4_N: U?#12.16(D4N) ; port DAC_D4_N
DAC_D4_P: U?#12.15(D4P) ; port DAC_D4_P
DAC_D5_N: U?#12.14(D5N) ; port DAC_D5_N
DAC_D5_P: U?#12.13(D5P) ; port DAC_D5_P
DAC_D6_N: U?#12.12(D6N) ; port DAC_D6_N
DAC_D6_P: U?#12.11(D6P) ; port DAC_D6_P
DAC_D7_N: U?#12.10(D7N) ; port DAC_D7_N
DAC_D7_P: U?#12.9(D7P) ; port DAC_D7_P
DAC_DCI_N: U?#12.18(DCIN) ; port DAC_DCI_N
DAC_DCI_P: U?#12.17(DCIP) ; port DAC_DCI_P
DAC_FRAME_N: U?#12.20(FRAMEN) ; port DAC_FRAME_N
DAC_FRAME_P: U?#12.19(FRAMEP) ; port DAC_FRAME_P
DAC_~{IRQ}: R?#60.1 U?#16.34(~{IRQ}) ; port DAC_~{IRQ}
DAC_OUT1: R?#48.1 ; port DAC_OUT1
DAC_OUT2: R?#55.1 ; port DAC_OUT2
DAC_~{RST}: U?#16.36(~{RESET}) ; port DAC_~{RST}
DAC_REFCLK_N: U?#16.7(REFCLKN) ; port DAC_REFCLK_N
DAC_REFCLK_P: U?#16.6(REFCLKP) ; port DAC_REFCLK_P
DAC_SCLK: U?#16.32(SCLK) ; port DAC_SCLK
DAC_SDIO: U?#16.31(SDIO) ; port DAC_SDIO
DAC_TXEN: U?#16.30(TXENABLE) ; port DAC_TXEN
NetC?#29_1: C?#29.1 L?#3.1 R?#49.2
NetC?#29_2: C?#29.2 L?#2.1 R?#47.2
NetC?#30_1: C?#30.1 L?#5.1 R?#56.2
NetC?#30_2: C?#30.2 L?#4.1 R?#54.2
NetC?#31_2: C?#31.2 U?#16.42(REFIO)
NetC?#35_2: C?#35.2 C?#36.2 C?#37.2 C?#38.2 C?#40.2 C?#41.2 C?#42.2
NetL?#2_2: L?#2.2 R?#50.2 U?#12.47(IOUT1P)
NetL?#3_2: L?#3.2 R?#51.2 U?#12.46(IOUT1N)
NetL?#4_2: L?#4.2 R?#57.2 U?#12.38(IOUT2P)
NetL?#5_2: L?#5.2 R?#58.2 U?#12.39(IOUT2N)
NetR?#46_1: R?#46.1 R?#48.2 U?#13.1(OUT1)
NetR?#46_2: R?#46.2 R?#47.1 U?#13.2(-IN1)
NetR?#49_1: R?#49.1 R?#52.2 U?#13.3(+IN1)
NetR?#53_1: R?#53.1 R?#55.2 U?#14.7(OUT2)
NetR?#53_2: R?#53.2 R?#54.1 U?#14.6(-IN2)
NetR?#56_1: R?#56.1 R?#59.2 U?#14.5(+IN2)
NetR?#61_2: R?#61.2 U?#16.43(FSADJ)

### Layout directives
differential pair: (no net found under the mark)

### Notes on the sheet
- DATA - DAC - Filter
- LVDS18
  Internal Impedance 80-120 for LVDS Diff input
  DCI = Data Clock In
- DCI = 400Mhz
  FRAME = 200Mhz
  Sur FPGA
- Power
- Control
- AVDD33 -> ~54mA
  DVDD -> IO
  CDVV -> Clock PLL ~80mA
  1200-400-200MHz
- CLK = 400Mhz
  REF CLK = 400Mhz
- Sheet Name
- Project Title
- Global Project
- Size
- Group
- Revision
- Date
- Sheet
- of
- Filename
- Designers
- (in symbol DAC_AD9146BCPZ, part A) DAC; DATA RECEIVER

### Library data of the parts
C?#29-C?#31 = CAP - 0603: Precision: 10%; Current: *; CreatedBy: Jonathan Bouchard; Power: *
  C?#29 C?#30: Value: *
C?#32-C?#42 = CAP - 0402: Precision: 10%; Current: *; CreatedBy: Jonathan Bouchard; Power: *
U?#12 U?#15 U?#16 = DAC_AD9146BCPZ: DAC - 16BIT SRL HIGH SPEED - QFN-48; Voltage: 3.13 V ~ 3.47 V / 1.71 V ~ 1.89 V; Mfg: Analog Devices Inc.; Current: *; Power: *; Mfg Part Number: AD9146BCPZ; HelpURL: http://www.analog.com/media/en/technical-documentation/data-sheets/AD9146.PDF; CreatedBy: Jonathan Bouchard; Temperature: -40°C ~ 85°C; Value: *; Precision: 16 Bit; Package: QFN-48; Supplier 1: Digikey; Supplier Part Number 1: AD9146BCPZ-ND
U?#13 U?#14 = OPAMP_AD8056ARMZ: OPAMP - VFB 300MHZ - 8MSOP; Voltage: 8 V ~ 12 V, ±4 V ~ 6 V; Current: 60mA; Mfg: Analog Devices; Power: *; Mfg Part Number: AD8056ARMZ; HelpURL: http://www.analog.com/media/en/technical-documentation/data-sheets/AD8055_8056.pdf; CreatedBy: Jonathan Bouchard; Temperature: -40°C ~ 125°C; Value: *; Precision: *; Package: MSOP-8; Supplier 1: Digikey; Supplier Part Number 1: AD8056ARMZ-REEL7CT-ND
L?#2-L?#5 = FER - 0603: Voltage: *; CreatedBy: Jonathan Bouchard; Power: *; Precision: *
R?#46-R?#61 = RES - 0603: Current: *; CreatedBy: Jonathan Bouchard
  R?#46-R?#59: Value: *